# EAGLE board DP_current_measure_v3 (EAGLE 9.6.0), part 1 of 2
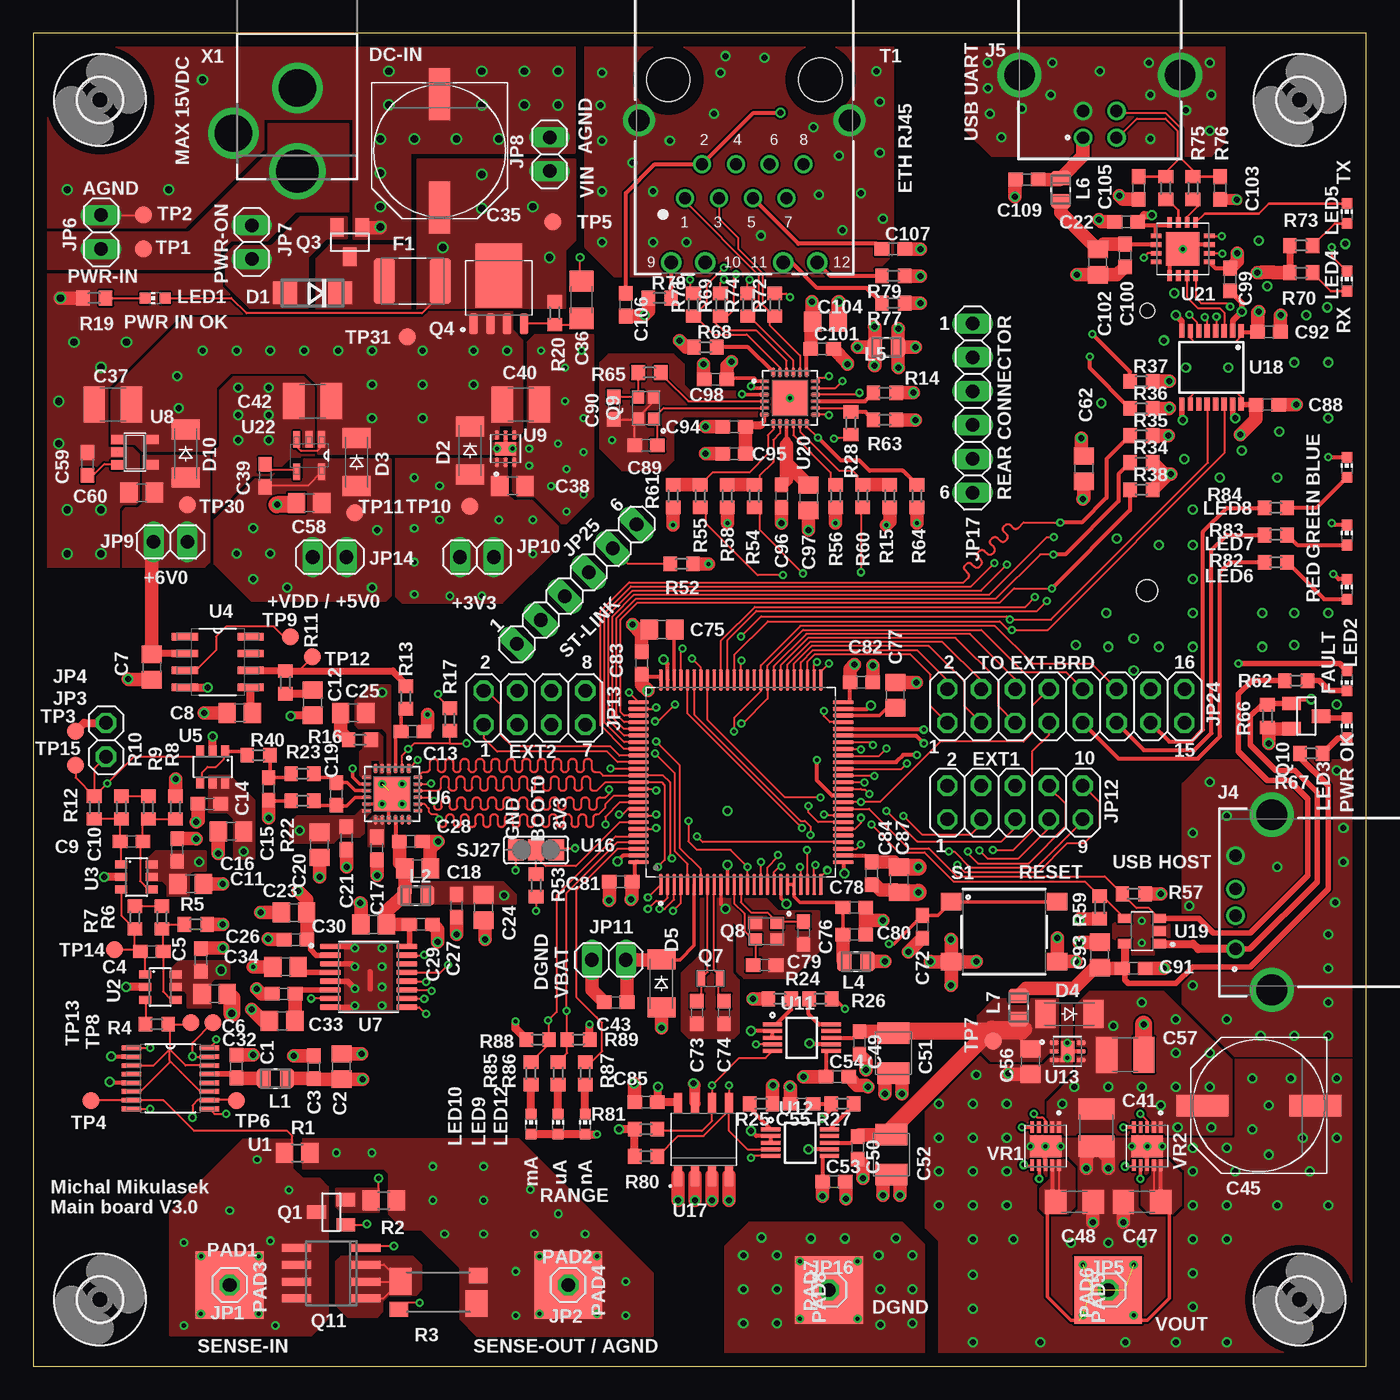
[diagram p6: board, top side]
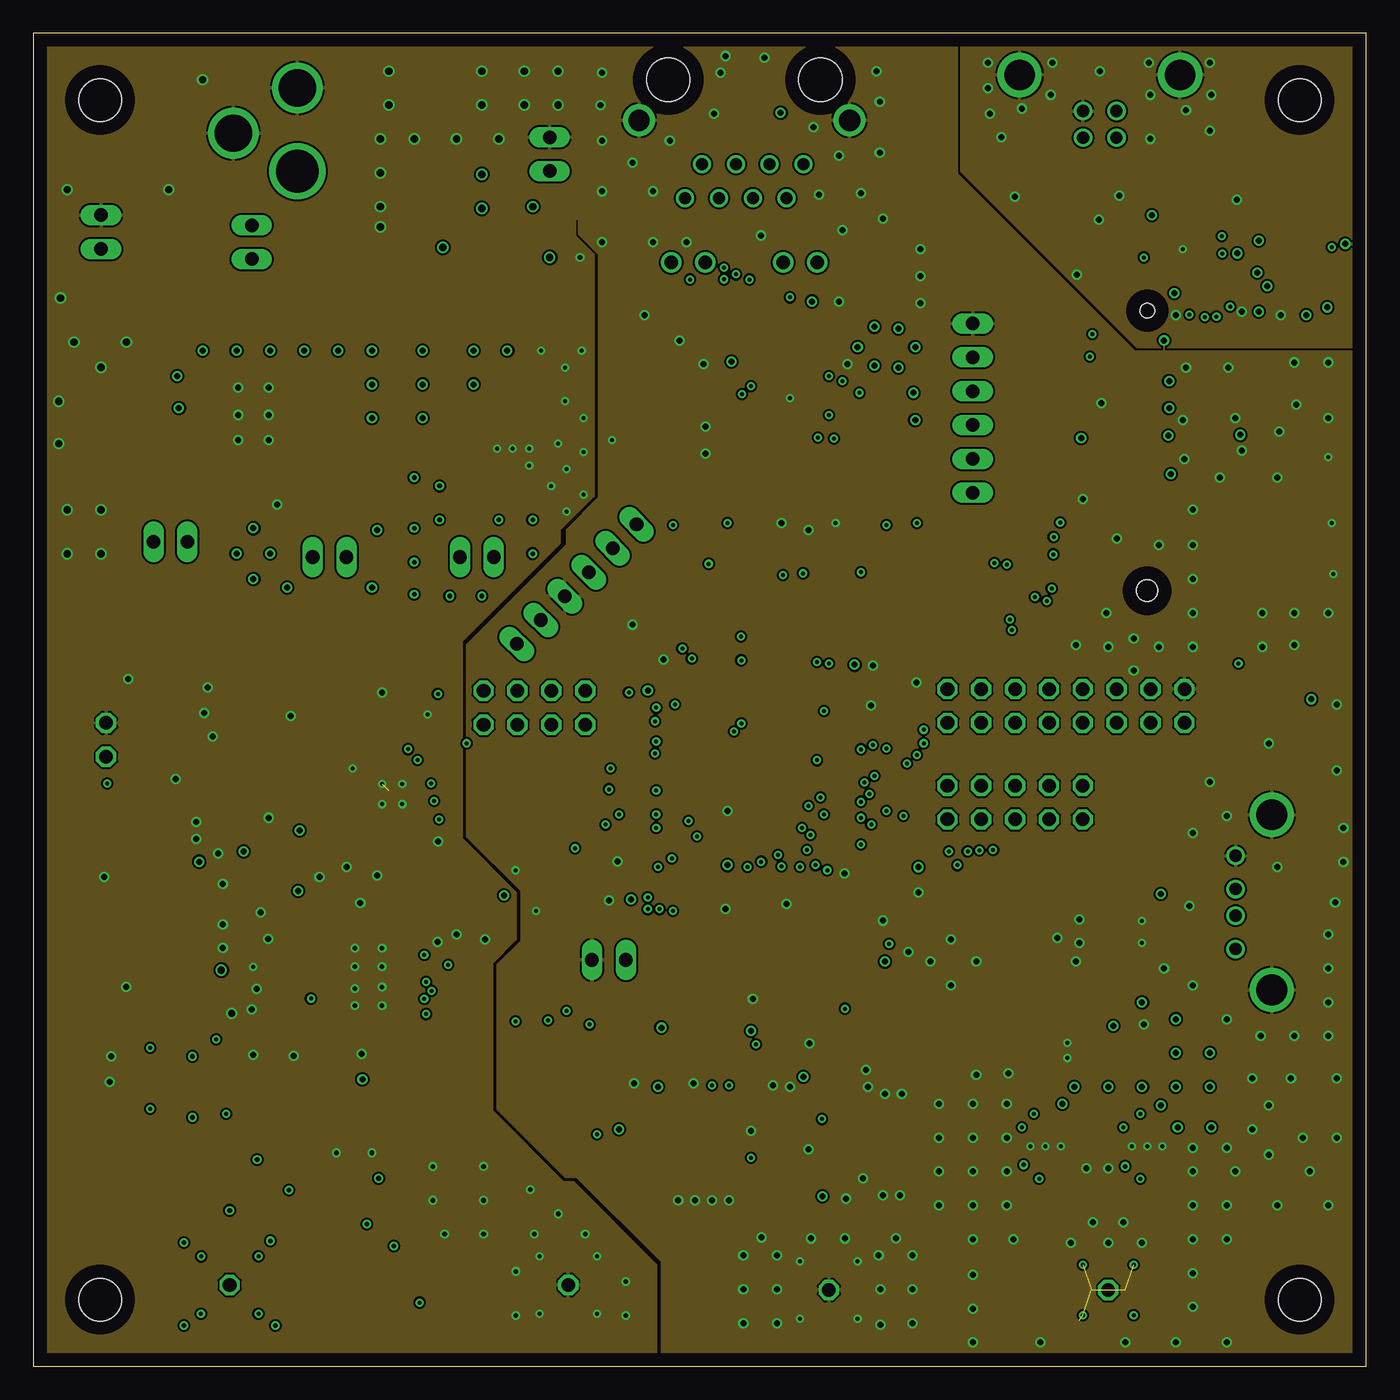
[diagram p7: board, inner layer Route2]
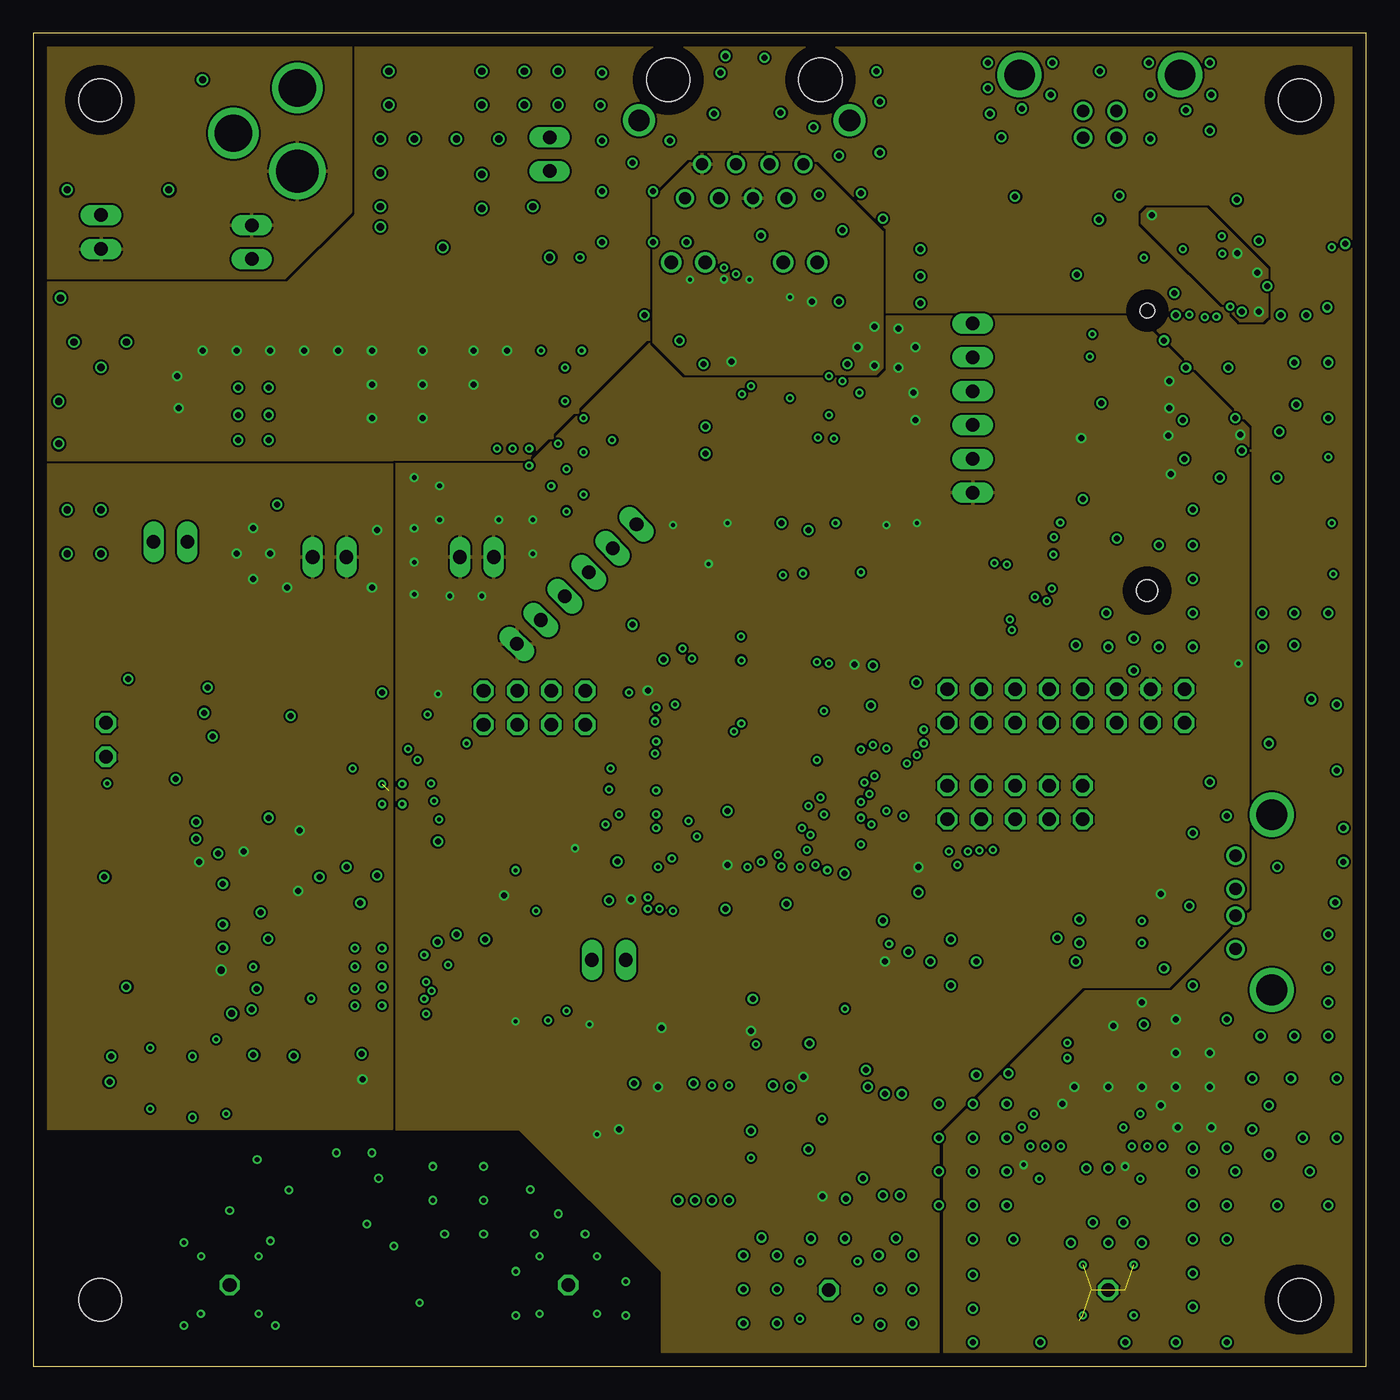
[diagram p8: board, inner layer Route15]
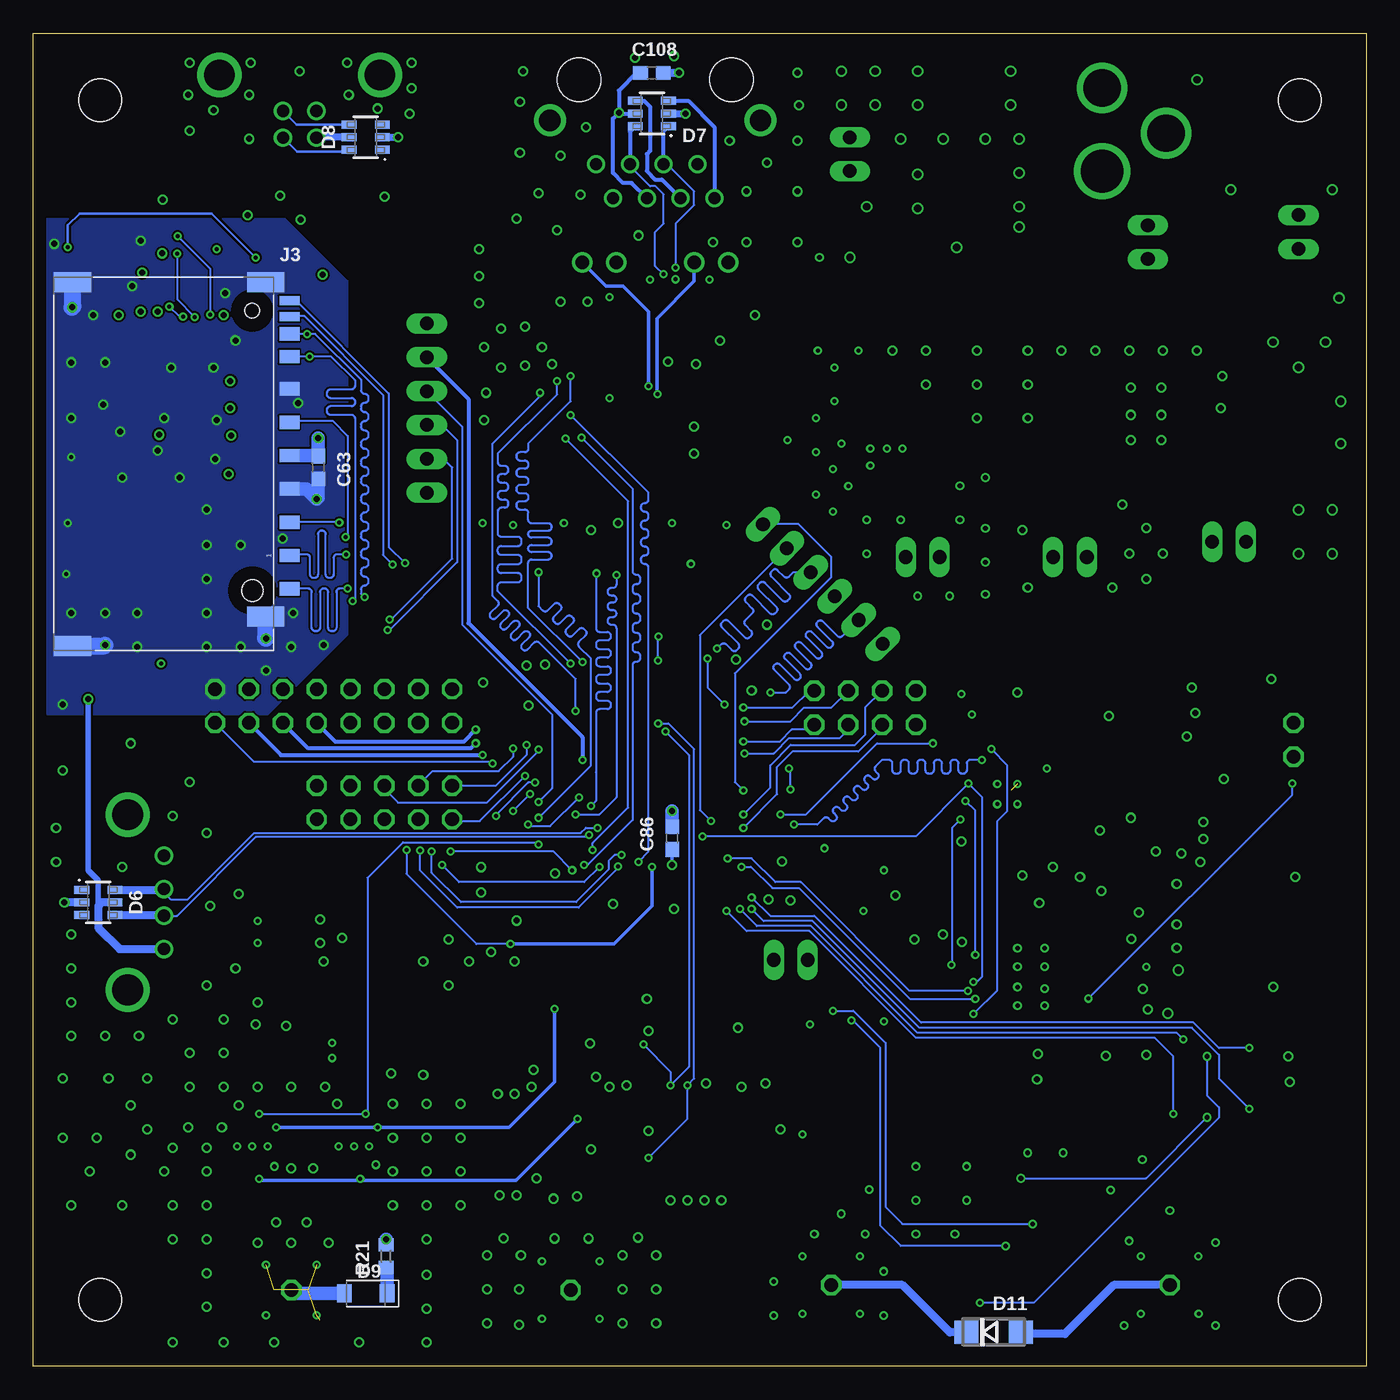
[diagram p9: board, bottom side, seen from below]

Size 100 x 100 mm. Coordinates in mm from the lower left corner, seen from the top.
Outline: 0,0 100,0 100,100 0,100 0,0
Copper layers (1+2*15+16): Top 0.035mm / dielectric 0.2mm / Route2 0.035mm / dielectric 1mm / Route15 0.035mm / dielectric 0.2mm / Bottom 0.035mm
Design rules "PCB_way_4L": minimum track width 6mil, minimum drill 0.3mm, track to track 6mil, track to pad 6mil, pad to pad 6mil, via to via 6mil, smd to smd 6mil, copper to edge 40mil, drill to drill 6mil, minimum pad ring 6mil, minimum via ring 6mil, stop-mask expansion 4mil, vias tented up to drill 0mil, thermal gap 6mil
Net classes: 1 diff_pair: width 0.152 mm

## Footprints (pad centres in the part's own frame; a part is rotated, then mirrored left to right if it is on the bottom)
C0603 = smd 1.1 x 1: 1 -0.85,0; 2 0.85,0
C0805 = smd 1.3 x 1.5: 1 -0.95,0; 2 0.95,0
PANASONIC_G = smd 3.9 x 1.6: + 4.25,0; - -4.25,0
C1206 = smd 1.6 x 1.8: 1 -1.4,0; 2 1.4,0
C1210 = smd 1.6 x 2.7: 1 -1.4,0; 2 1.4,0
SMC_B = smd 1.6 x 2.4: + -1.5,0; - 1.5,0
DO214AC = smd 1.8 x 1.7: A 2.05,0; C -2.05,0
SOD-123_MINI-SMA = smd 1.5 x 2.1: A 1.8,0; C -1.8,0
WE-TVS_SOT23-6L = smd 0.6 x 1.1: 1 -0.95,-1.25; 2 0,-1.25; 3 0.95,-1.25; 4 0.95,1.25; 5 0,1.25; 6 -0.95,1.25
SODFL3718X115 = smd 1.115 x 1.361: 1 -1.6,0; 2 1.6,0
1812 = smd 1.58 x 3.43: 1 -2.1,0; 2 2.1,0
3,2 = hole 3.2: 0,0
693063020911 = smd 1 x 1.5: 1 6.875,0; 2 4.375,0; 3 1.875,0; 4 -0.625,0; 5 -3.125,0; 6 -5.625,0; 7 -8.05,0; 8 -9.75,0; 9 9.375,0 | smd 0.7 x 1.5: CD -11.05,0; WP -12.25,0 | smd 1.5 x 2.8: GND1 -13.65,-1.8; GND2 11.45,-1.8; GND3 13.65,-16.3; GND4 -13.65,-16.3 | hole 1.1: -11.5,-2.8 | hole 1.6: 9.5,-2.8
614004190021 = drill 0.92: 1 -3.5,5.935; 2 -1,5.935; 3 1,5.935; 4 3.5,5.935 | drill 2.3: S1 -6.57,3.225; S2 6.57,3.225
61400416121 = drill 0.92: 1 1.25,6.74; 2 -1.25,6.74; 3 -1.25,4.74; 4 1.25,4.74 | drill 2.3: S1 -6.02,2.03; S2 6.02,2.03
1X01 = drill 1.016 octagon: 1 0,0
1X02 = drill 1.016 long: 1 -1.27,0; 2 1.27,0
2X05 = drill 1.016 octagon: 1 -5.08,-1.27; 2 -5.08,1.27; 3 -2.54,-1.27; 4 -2.54,1.27; 5 0,-1.27; 6 0,1.27; 7 2.54,-1.27; 8 2.54,1.27; 9 5.08,-1.27; 10 5.08,1.27
2X04 = drill 1.016 octagon: 1 -3.81,-1.27; 2 -3.81,1.27; 3 -1.27,-1.27; 4 -1.27,1.27; 5 1.27,-1.27; 6 1.27,1.27; 7 3.81,-1.27; 8 3.81,1.27
1X06 = drill 1.016 long: 1 -6.35,0; 2 -3.81,0; 3 -1.27,0; 4 1.27,0; 5 3.81,0; 6 6.35,0
2X08 = drill 1.016 octagon: 1 -8.89,-1.27; 2 -8.89,1.27; 3 -6.35,-1.27; 4 -6.35,1.27; 5 -3.81,-1.27; 6 -3.81,1.27; 7 -1.27,-1.27; 8 -1.27,1.27; 9 1.27,-1.27; 10 1.27,1.27; 11 3.81,-1.27; 12 3.81,1.27; 13 6.35,-1.27; 14 6.35,1.27; 15 8.89,-1.27; 16 8.89,1.27
BLM21PG331SN1D = smd 1.09 x 1.47: 1 -0.865,0; 2 0.865,0
CHIP-LED0603 = smd 0.8 x 0.8: A 0,-0.75; C 0,0.75
SMD2,54-5,08 = smd 2.54 x 5.08: 1 0,0
SOT23 = smd 1 x 1.4: 1 -0.95,-1.1; 2 0.95,-1.1; 3 0,1.1
TO127P600X120-5N = smd 0.64 x 1.57: 1 -1.905,-2.57; 2 -0.635,-2.57; 3 0.635,-2.57; 4 1.905,-2.57 | smd 3.47 x 4.8: 5 0,1.06
WE-XTAL_IQXC-25 = smd 0.6 x 1.1: 1 -0.7,0; 2 0.7,0
WE-XTAL_CFPX-218 = smd 1 x 0.9: 1 -0.825,-0.613; 2 0.825,-0.613; 3 0.825,0.613; 4 -0.825,0.613
SO8 = smd 0.6 x 2.2: 1 -1.905,-2.6; 2 -0.635,-2.6; 3 0.635,-2.6; 4 1.905,-2.6; 5 1.905,2.6; 6 0.635,2.6; 7 -0.635,2.6; 8 -1.905,2.6
R0805 = smd 1.3 x 1.5: 1 -0.95,0; 2 0.95,0
R2512 = smd 1.39 x 1.14: E1 -0.13,-2.105; E2 5.84,0.435 | smd 1.65 x 2.01: I1 0,0; I2 5.71,-1.67
R0603 = smd 1 x 1.1: 1 -0.85,0; 2 0.85,0
430152080836 = smd 1.55 x 1.3: 1 -3.975,2.25; 2 -3.975,-2.25; 3 3.975,2.25; 4 3.975,-2.25
SJ_2 = smd 1.168 x 1.6: 1 -1.524,0; 2 0,0; 3 1.524,0
7499010121A = drill 0.9: 1 -4.445,-8.89; 2 -3.175,-6.35; 3 -1.905,-8.89; 4 -0.635,-6.35; 5 0.635,-8.89; 6 1.905,-6.35; 7 3.175,-8.89; 8 4.445,-6.35 | drill 1.02: 9 -5.465,-13.72; 10 -2.925,-13.72; 11 2.925,-13.72; 12 5.465,-13.72 | drill 1.6: Z1 -7.9,-3.05; Z2 7.9,-3.05 | hole 3.25: -5.715,0; 5.715,0
B1,27 = smd 1.27 x 1.27: TP 0,0
SOP65P640X110-16N = smd 1.473 x 0.356: 1 -2.921,2.286; 2 -2.921,1.626; 3 -2.921,0.965; 4 -2.921,0.33; 5 -2.921,-0.33; 6 -2.921,-0.965; 7 -2.921,-1.626; 8 -2.921,-2.286; 9 2.921,-2.286; 10 2.921,-1.626; 11 2.921,-0.965; 12 2.921,-0.33; 13 2.921,0.33; 14 2.921,0.965; 15 2.921,1.626; 16 2.921,2.286
SOT23-6 = smd 0.6 x 0.9: 1 -0.95,-1.15; 2 0,-1.15; 3 0.95,-1.15; 4 0.95,1.15; 5 0,1.15; 6 -0.95,1.15
SOIC127P600X175-8N = smd 1.981 x 0.559: 1 -2.464,1.905; 2 -2.464,0.635; 3 -2.464,-0.635; 4 -2.464,-1.905; 5 2.464,-1.905; 6 2.464,-0.635; 7 2.464,0.635; 8 2.464,1.905
24-VFQFN = smd 0.26 x 0.69: 1 -1.25,-1.92; 2 -0.75,-1.92; 3 -0.25,-1.92; 4 0.25,-1.92; 5 0.75,-1.92; 6 1.25,-1.92; 13 1.25,1.92; 14 0.75,1.92; 15 0.25,1.92; 16 -0.25,1.92; 17 -0.75,1.92; 18 -1.25,1.92 | smd 0.69 x 0.26: 7 1.92,-1.25; 8 1.92,-0.75; 9 1.92,-0.25; 10 1.92,0.25; 11 1.92,0.75; 12 1.92,1.25; 19 -1.92,1.25; 20 -1.92,0.75; 21 -1.92,0.25; 22 -1.92,-0.25; 23 -1.92,-0.75; 24 -1.92,-1.25 | smd 2.7 x 2.6: 25 0,0
SOP65P640X120-16N = smd 1.57 x 0.41: 1 -2.87,2.275; 2 -2.87,1.625; 3 -2.87,0.975; 4 -2.87,0.325; 5 -2.87,-0.325; 6 -2.87,-0.975; 7 -2.87,-1.625; 8 -2.87,-2.275; 9 2.87,-2.275; 10 2.87,-1.625; 11 2.87,-0.975; 12 2.87,-0.325; 13 2.87,0.325; 14 2.87,0.975; 15 2.87,1.625; 16 2.87,2.275
SOT23-5 = smd 0.69 x 0.99: 1 -0.95,-1.29; 2 0,-1.29; 3 0.95,-1.29; 4 0.95,1.3; 5 -0.95,1.3
SON65P200X200X80-7N = smd 0.69 x 0.32: 1 -1.02,0.65; 2 -1.02,0; 3 -1.02,-0.65; 4 1.02,-0.65; 5 1.02,0; 6 1.02,0.65 | smd 1 x 1.6: 7 0,0
SOP50P490X95-10N = smd 1.45 x 0.3: 1 -2.2,1; 2 -2.2,0.5; 3 -2.2,0; 4 -2.2,-0.5; 5 -2.2,-1; 6 2.2,-1; 7 2.2,-0.5; 8 2.2,0; 9 2.2,0.5; 10 2.2,1
QFP50P1600X1600X160-100N = smd 1.56 x 0.28: 1 -7.68,6; 2 -7.68,5.5; 3 -7.68,5; 4 -7.68,4.5; 5 -7.68,4; 6 -7.68,3.5; 7 -7.68,3; 8 -7.68,2.5; 9 -7.68,2; 10 -7.68,1.5; 11 -7.68,1; 12 -7.68,0.5; 13 -7.68,0; 14 -7.68,-0.5; 15 -7.68,-1; 16 -7.68,-1.5; 17 -7.68,-2; 18 -7.68,-2.5; 19 -7.68,-3; 20 -7.68,-3.5; 21 -7.68,-4; 22 -7.68,-4.5; 23 -7.68,-5; 24 -7.68,-5.5; 25 -7.68,-6; 51 7.68,-6; 52 7.68,-5.5; 53 7.68,-5; 54 7.68,-4.5; 55 7.68,-4; 56 7.68,-3.5; 57 7.68,-3; 58 7.68,-2.5; 59 7.68,-2; 60 7.68,-1.5; 61 7.68,-1; 62 7.68,-0.5; 63 7.68,0; 64 7.68,0.5; 65 7.68,1; 66 7.68,1.5; 67 7.68,2; 68 7.68,2.5; 69 7.68,3; 70 7.68,3.5; 71 7.68,4; 72 7.68,4.5; 73 7.68,5; 74 7.68,5.5; 75 7.68,6 | smd 0.28 x 1.56: 26 -6,-7.68; 27 -5.5,-7.68; 28 -5,-7.68; 29 -4.5,-7.68; 30 -4,-7.68; 31 -3.5,-7.68; 32 -3,-7.68; 33 -2.5,-7.68; 34 -2,-7.68; 35 -1.5,-7.68; 36 -1,-7.68; 37 -0.5,-7.68; 38 0,-7.68; 39 0.5,-7.68; 40 1,-7.68; 41 1.5,-7.68; 42 2,-7.68; 43 2.5,-7.68; 44 3,-7.68; 45 3.5,-7.68; 46 4,-7.68; 47 4.5,-7.68; 48 5,-7.68; 49 5.5,-7.68; 50 6,-7.68; 76 6,7.68; 77 5.5,7.68; 78 5,7.68; 79 4.5,7.68; 80 4,7.68; 81 3.5,7.68; 82 3,7.68; 83 2.5,7.68; 84 2,7.68; 85 1.5,7.68; 86 1,7.68; 87 0.5,7.68; 88 0,7.68; 89 -0.5,7.68; 90 -1,7.68; 91 -1.5,7.68; 92 -2,7.68; 93 -2.5,7.68; 94 -3,7.68; 95 -3.5,7.68; 96 -4,7.68; 97 -4.5,7.68; 98 -5,7.68; 99 -5.5,7.68; 100 -6,7.68
SOIC127P600X175-8N' = smd 1.55 x 0.6: 1 -2.7,1.905; 2 -2.7,0.635; 3 -2.7,-0.635; 4 -2.7,-1.905; 5 2.7,-1.905; 6 2.7,-0.635; 7 2.7,0.635; 8 2.7,1.905
QSOP16 = smd 0.4 x 1: 1 -2.223,-2.75; 2 -1.588,-2.75; 3 -0.953,-2.75; 4 -0.318,-2.75; 5 0.318,-2.75; 6 0.953,-2.75; 7 1.588,-2.75; 8 2.223,-2.75; 9 2.223,2.75; 10 1.588,2.75; 11 0.953,2.75; 12 0.318,2.75; 13 -0.318,2.75; 14 -0.953,2.75; 15 -1.588,2.75; 16 -2.223,2.75
SOT-23-5 = smd 1 x 0.7: 1 -1.3,0.95; 2 -1.3,0; 3 -1.3,-0.95; 4 1.3,-0.95; 5 1.3,0.95
QFN16-4X4 = smd 0.8 x 0.35: 1 -2,0.975; 2 -2,0.325; 3 -2,-0.325; 4 -2,-0.975; 9 2,-0.975; 10 2,-0.325; 11 2,0.325; 12 2,0.975 | smd 0.35 x 0.8: 5 -0.975,-2; 6 -0.325,-2; 7 0.325,-2; 8 0.975,-2; 13 0.975,2; 14 0.325,2; 15 -0.325,2; 16 -0.975,2 | smd 2.5 x 2.5: EXP 0,0
SOT95P280X100-5N = smd 1.219 x 0.508: 1 -1.219,0.94; 2 -1.219,0; 3 -1.219,-0.94; 4 1.219,-0.94; 5 1.219,0.94
SON50P300X300X80-11N = smd 0.86 x 0.27: 1 -1.435,1; 2 -1.435,0.5; 3 -1.435,0; 4 -1.435,-0.5; 5 -1.435,-1; 6 1.435,-1; 7 1.435,-0.5; 8 1.435,0; 9 1.435,0.5; 10 1.435,1 | smd 1.65 x 2.38: 11 0,0
DCJACK_2MM_PTH = drill 2.8: GND 0,7.35; GNDBREAK 4.8,10.75 | drill 3.2: PWR 0,13.6

## Placement (x,y rotation side)
C1  100n / 0603  [C0603]  15.24,22.48 90 top
C2  10u / 0805  [C0805]  23.11,22.48 90 top
C3  100n / 0603  [C0603]  21.06,22.43 90 top
C4  10p / 0603 NP0  [C0603]  8.89,31.11 180 top
C5  100n / 0603  [C0603]  12.57,30.48 90 top
C6  10u / 0805  [C0805]  13.59,27.94 0 top
C7  10u / 0805  [C0805]  8.89,52.45 270 top
C8  10u / 0805  [C0805]  15.49,49.02 180 top
C9  10p / 0603 NP0  [C0603]  7.37,39.37 180 top
C10  100n / 0603  [C0603]  10.79,38.73 90 top
C11  10u / 0805  [C0805]  11.81,36.2 0 top
C12  10u / 0805  [C0805]  20.95,49.78 270 top
C13  1u / 0603  [C0603]  28.45,47.62 0 top
C14  100n / 0603  [C0603]  13.21,42.19 180 top
C15  10n / 0603  [C0603]  17.65,43.31 270 top
C16  10u / 0805  [C0805]  14.83,40.13 180 top
C17  1u / 0603  [C0603]  25.78,38.86 270 top
C18  10u / 0805  [C0805]  28.83,37.34 0 top
C19  10n / 0603 NP0  [C0603]  22.73,42.93 270 top
C20  10u / 0805  [C0805]  21.46,39.12 270 top
C21  100n / 0603  [C0603]  23.5,39.62 270 top
C22  100n / 0603  [C0603]  81.99,85.85 180 top
C23  10u / 0805  [C0805]  19.56,34.04 180 top
C24  10u / 0805  [C0805]  33.78,34.42 270 top
C25  22u / 0805  [C0805]  24,49.02 0 top
C26  100n / 0603  [C0603]  19.68,32 180 top
C27  100n / 0603  [C0603]  31.75,34.54 270 top
C28  100n / 0603  [C0603]  28.32,39.37 0 top
C29  100n / 0603  [C0603]  29.08,33.15 0 top
C30  10u / 0805  [C0805]  25.53,33.15 180 top
C32  1u / 0603  [C0603]  18.8,27.94 180 top
C33  10u / 0805  [C0805]  18.67,25.91 180 top
C34  10u / 0805  [C0805]  18.92,29.97 180 top
C35  470u  [PANASONIC_G]  30.48,91.19 270 top
C36  10u / 1206  [C1206]  41.15,80.01 90 top
C37  22u / 1210  [C1210]  5.97,72.14 180 top
C38  10u / 0805  [C0805]  35.94,66.04 0 top
C39  10n / 0603  [C0603]  17.4,66.8 270 top
C40  22u / 1210  [C1210]  36.58,72.14 0 top
C41  22u / 1210  [C1210]  79.76,17.91 270 top
C42  22u / 1210  [C1210]  20.95,72.39 180 top
C43  100n / 0603  [C0603]  43.69,27.3 180 top
C45  470u  [PANASONIC_G]  91.95,19.56 180 top
C47  10u / 1206  [C1206]  83.19,12.32 180 top
C48  10u / 1206  [C1206]  78.11,12.32 0 top
C49  100n / 0603  [C0603]  61.98,24.26 270 top
C50  100n / 0603  [C0603]  61.85,16.38 270 top
C51  10u  [SMC_B]  64.52,23.5 270 top
C52  10u  [SMC_B]  64.39,15.88 270 top
C53  100n / 0603  [C0603]  60.07,13.84 0 top
C54  100n / 0603  [C0603]  60.33,21.72 0 top
C55  470n / 0603  [C0603]  57.66,19.68 180 top
C56  10u / 0805  [C0805]  74.8,22.86 270 top
C57  22u / 1210  [C1210]  81.92,23.37 0 top
C58  10u / 0805  [C0805]  20.7,64.77 180 top
C59  100n / 0603  [C0603]  4.06,67.69 90 top
C60  10u / 0805  [C0805]  8.13,65.53 180 top
C62  10u / 0805  [C0805]  78.82,67.34 270 top
C63  100n / 0603  [C0603]  78.61,67.44 270 bottom
C72  100n / 0603  [C0603]  66.7,32.97 270 top
C73  14p / 0603 NP0  [C0603]  49.78,26.54 270 top
C74  14p / 0603 NP0  [C0603]  51.82,26.54 270 top
C75  2,2u / 0805  [C0805]  47.17,55.27 180 top
C76  12pF / 0603 NP0  [C0603]  57.78,32.51 270 top
C77  2,2u / 0805  [C0805]  64.67,50.34 90 top
C78  100n / 0603  [C0603]  61.59,34.42 0 top
C79  12pF / 0603 NP0  [C0603]  54.86,30.1 0 top
C80  1u / 0603  [C0603]  61.59,32.38 0 top
C81  100n / 0603  [C0603]  44.07,36.35 180 top
C82  100n / 0603  [C0603]  62.13,51.31 0 top
C83  100n / 0603  [C0603]  45.64,52.76 90 top
C84  100n / 0603  [C0603]  62.89,36.98 270 top
C85  100n / 0603  [C0603]  45.97,19.81 180 top
C86  100n / 0603  [C0603]  52.07,39.62 90 bottom
C87  10u / 0805  [C0805]  64.95,36.5 270 top
C88  100n / 0603  [C0603]  92.58,72.14 0 top
C89  12pF / 0603 NP0  [C0603]  45.97,69.09 180 top
C90  12pF / 0603 NP0  [C0603]  43.56,71.88 270 top
C91  100n / 0603  [C0603]  82.55,29.84 0 top
C92  100n / 0603  [C0603]  92.71,77.6 0 top
C93  10u / 0805  [C0805]  80.01,30.86 90 top
C94  470p / 0603  [C0603]  52.58,70.48 180 top
C95  1u / 0603  [C0603]  52.58,68.45 180 top
C96  100n / 0603  [C0603]  56.13,65.28 270 top
C97  10u / 0805  [C0805]  58.17,65.15 270 top
C98  100n / 0603  [C0603]  51.18,74.04 180 top
C99  100n / 0603  [C0603]  89.79,81.53 270 top
C100  100n / 0603  [C0603]  81.92,83.34 270 top
C101  100n / 0603  [C0603]  59.18,76.33 0 top
C102  10u / 0805  [C0805]  79.86,82.83 270 top
C103  47p / 0603  [C0603]  89.03,88.39 270 top
C104  10u / 0805  [C0805]  59.44,78.36 0 top
C105  47p / 0603  [C0603]  82.93,88.39 270 top
C106  100n / 0603  [C0603]  44.45,79.63 270 top
C107  100n / 0603  [C0603]  64.52,83.82 0 top
C108  100n / 0603  [C0603]  53.59,97.03 0 bottom
C109  10n / 0603  [C0603]  74.55,89.03 180 top
D1  S3M  [DO214AC]  20.95,80.52 180 top
D2  1N5819HW-7-F  [SOD-123_MINI-SMA]  32.77,68.71 270 top
D3  1N5819HW-7-F  [SOD-123_MINI-SMA]  24.26,67.82 270 top
D4  1N5819HW-7-F  [SOD-123_MINI-SMA]  77.72,26.42 180 top
D5  1N5819HW-7-F  [SOD-123_MINI-SMA]  47.12,28.7 270 top
D6  USBLC6-4SC6  [WE-TVS_SOT23-6L]  95.12,34.8 270 bottom
D7  USBLC6-4SC6  [WE-TVS_SOT23-6L]  53.59,93.98 90 bottom
D8  USBLC6-4SC6  [WE-TVS_SOT23-6L]  75.06,92.2 90 bottom
D9  BZT52-B5V6J  [SODFL3718X115]  75.06,5.46 180 bottom
D10  1N5819HW-7-F  [SOD-123_MINI-SMA]  11.43,68.45 270 top
D11  Clamp_diode  [DO214AC]  27.94,2.54 0 bottom
F1  [1812]  28.45,81.41 0 top
H1  MOUNT-HOLE3.2  [3,2]  5,95 0 top
H2  MOUNT-HOLE3.2  [3,2]  5,5 0 top
H3  MOUNT-HOLE3.2  [3,2]  95,95 0 top
H4  MOUNT-HOLE3.2  [3,2]  95,5 0 top
J3  [693063020911]  80.77,67.69 270 bottom
J4  [614004190021]  96.14,34.8 90 top
J5  [61400416121]  80.01,98.91 180 top
JP1  [1X01]  14.73,6.1 90 top
JP2  [1X01]  40.13,6.1 90 top
JP3  [1X01]  5.46,45.72 90 top
JP4  [1X01]  5.46,48.26 90 top
JP5  [1X01]  80.64,5.71 0 top
JP6  [1X02]  5.08,85.09 90 top
JP7  [1X02]  16.38,84.33 270 top
JP8  [1X02]  38.73,90.93 90 top
JP9  [1X02]  10.29,61.85 0 top
JP10  [1X02]  33.27,60.71 0 top
JP11  [1X02]  43.18,30.48 180 top
JP12  [2X05]  73.66,42.29 0 top
JP13  [2X04]  37.59,49.4 0 top
JP14  [1X02]  22.23,60.71 0 top
JP16  [1X01]  59.69,5.71 0 top
JP17  [1X06]  70.48,71.88 270 top
JP24  [2X08]  77.47,49.53 0 top
JP25  [1X06]  40.77,58.67 45 top
L1  [BLM21PG331SN1D]  18.16,21.59 0 top
L2  [BLM21PG331SN1D]  28.7,35.31 0 top
L4  [BLM21PG331SN1D]  61.72,30.35 180 top
L5  [BLM21PG331SN1D]  64.01,76.45 180 top
L6  [BLM21PG331SN1D]  77.09,88.27 90 top
L7  [BLM21PG331SN1D]  73.91,26.92 90 top
LED1  GREEN_TOP  [CHIP-LED0603]  9.14,80.14 90 top
LED2  RED_SIDE  [CHIP-LED0603]  98.55,51.44 180 top
LED3  GREEN_SIDE  [CHIP-LED0603]  98.55,47.88 0 top
LED4  GREEN_SIDE  [CHIP-LED0603]  98.55,81.41 0 top
LED5  GREEN_SIDE  [CHIP-LED0603]  98.55,86.49 0 top
LED6  RED_TOP  [CHIP-LED0603]  98.55,58.29 0 top
LED7  GREEN_TOP  [CHIP-LED0603]  98.55,62.36 0 top
LED8  BLUE_TOP  [CHIP-LED0603]  98.55,67.44 0 top
LED9  GREEN_TOP  [CHIP-LED0603]  39.37,18.16 0 top
LED10  BLUE_TOP  [CHIP-LED0603]  37.34,18.16 0 top
LED12  RED_TOP  [CHIP-LED0603]  41.4,18.16 0 top
PAD1  [SMD2,54-5,08]  16,6.1 180 top
PAD2  [SMD2,54-5,08]  38.86,6.1 180 top
PAD3  [SMD2,54-5,08]  13.46,6.1 180 top
PAD4  [SMD2,54-5,08]  41.4,6.1 180 top
PAD5  [SMD2,54-5,08]  81.92,5.71 0 top
PAD6  [SMD2,54-5,08]  79.38,5.71 0 top
PAD7  [SMD2,54-5,08]  58.42,5.71 0 top
PAD8  [SMD2,54-5,08]  60.96,5.71 0 top
Q1  DMG3414UQ-7  [SOT23]  22.35,11.56 90 top
Q3  DMG3401LSN-7  [SOT23]  23.75,84.33 180 top
Q4  PHPT60603NYX  [TO127P600X120-5N]  34.92,80.77 0 top
Q7  32.768kHz (9pF)/±10 ppm  [WE-XTAL_IQXC-25]  50.8,29.08 0 top
Q8  20MHz (8pF)/±10 ppm  [WE-XTAL_CFPX-218]  54.99,32.64 180 top
Q9  25MHz (8pF)/±10 ppm  [WE-XTAL_CFPX-218]  45.97,71.88 90 top
Q10  DMG3414UQ-7  [SOT23]  95.5,48.77 270 top
Q11  DMN2009USS  [SO8]  22.35,6.99 90 top
R1  10K 0.05%  [R0805]  19.81,16 0 top
R2  10R 0.05%  [R0805]  26.29,12.45 0 top
R3  R01 0.05%  [R2512]  33.27,4.7 180 top
R4  270R  [R0603]  9.27,25.65 180 top
R5  1K 0.05%  [R0603]  12.19,33.15 180 top
R6  6K8 0.05%  [R0603]  9.65,33.66 90 top
R7  2K2 0.05%  [R0603]  7.62,33.66 270 top
R8  1K 0.05%  [R0603]  10.67,41.91 90 top
R9  6K8 0.05%  [R0603]  8.64,41.91 270 top
R10  2K2 0.05%  [R0603]  6.6,41.91 90 top
R11  1R  [R0603]  18.92,51.31 270 top
R12  270R  [R0603]  4.57,41.91 90 top
R13  330R  [R0603]  27.94,50.16 270 top
R14  10K  [R0603]  63.88,73.03 180 top
R15  10K  [R0603]  64.26,65.28 90 top
R16  1R  [R0603]  24.51,46.99 0 top
R17  10K  [R0603]  31.24,48.51 90 top
R19  4K7  [R0603]  4.57,80.14 0 top
R20  1K  [R0603]  39.12,78.99 270 top
R21  1K  [R0603]  73.53,8.26 270 bottom
R22  2R2 1%  [R0603]  20.19,42.42 0 top
R23  2R2 1%  [R0603]  20.19,44.45 0 top
R24  1R  [R0603]  56.01,27.56 0 top
R25  1R  [R0603]  54.61,19.68 180 top
R26  330R  [R0603]  59.05,27.56 0 top
R27  4K7  [R0603]  60.71,19.68 180 top
R28  33R  [R0603]  61.34,70.74 270 top
R34  10K  [R0603]  83.13,67.79 0 top
R35  10K  [R0603]  83.13,69.82 0 top
R36  10K  [R0603]  83.13,71.86 0 top
R37  10K  [R0603]  83.13,73.89 0 top
R38  10K  [R0603]  83.13,65.76 0 top
R40  33R  [R0603]  16.89,45.85 0 top
R52  10K  [R0603]  48.64,60.2 0 top
R53  10K  [R0603]  37.72,36.07 90 top
R54  33R  [R0603]  54.1,65.28 270 top
R55  33R  [R0603]  50.04,65.28 270 top
R56  10K  [R0603]  60.2,65.28 270 top
R57  47K  [R0603]  82.55,35.43 180 top
R58  10K  [R0603]  52.07,65.28 90 top
R59  10K  [R0603]  80.01,34.42 270 top
R60  33R  [R0603]  62.23,65.28 270 top
R61  10K  [R0603]  48.01,65.28 90 top
R62  330R  [R0603]  94.74,51.44 180 top
R63  10K  [R0603]  63.88,70.99 180 top
R64  1K5  [R0603]  66.29,65.28 90 top
R65  500R  [R0603]  46.23,74.55 180 top
R66  10K  [R0603]  92.58,48.77 270 top
R67  330R  [R0603]  95.89,45.97 0 top
R68  12K1 1%  [R0603]  50.42,76.45 0 top
R69  49,9R  [R0603]  51.56,79.63 90 top
R70  330R  [R0603]  95.12,82.04 180 top
R71  49,9R  [R0603]  49.53,79.63 90 top
R72  49,9R  [R0603]  55.63,79.63 90 top
R73  330R  [R0603]  95.12,84.07 180 top
R74  49,9R  [R0603]  53.59,79.63 90 top
R75  27R  [R0603]  84.96,88.39 90 top
R76  27R  [R0603]  87,88.39 90 top
R77  270R  [R0603]  64.52,79.76 180 top
R78  270R  [R0603]  46.99,80.14 0 top
R79  10K  [R0603]  64.52,81.79 180 top
R80  4K7  [R0603]  45.97,15.75 180 top
R81  4K7  [R0603]  45.97,17.78 180 top
R82  330R  [R0603]  93.22,60.33 180 top
R83  330R  [R0603]  93.22,62.36 180 top
R84  330R  [R0603]  93.22,64.39 180 top
R85  330R  [R0603]  37.34,21.97 90 top
R86  330R  [R0603]  39.37,21.97 90 top
R87  330R  [R0603]  41.4,21.97 90 top
R88  10K  [R0603]  37.85,24.51 180 top
R89  10K  [R0603]  40.89,24.51 0 top
S1  [430152080836]  72.85,32.59 0 top
SJ27  [SJ_2]  37.72,38.73 0 top
T1  [7499010121A]  53.34,96.52 0 top
TP1  TPSB1,27  [B1,27]  8.26,83.82 0 top
TP2  TPSB1,27  [B1,27]  8.26,86.36 0 top
TP3  TPSB1,27  [B1,27]  3.17,47.62 0 top
TP4  TPSB1,27  [B1,27]  4.32,19.94 0 top
TP5  TPSB1,27  [B1,27]  38.99,85.85 0 top
TP6  TPSB1,27  [B1,27]  15.24,19.94 0 top
TP7  TPSB1,27  [B1,27]  72.01,24.38 90 top
TP8  TPSB1,27  [B1,27]  13.46,25.78 0 top
TP9  TPSB1,27  [B1,27]  19.3,54.74 0 top
TP10  TPSB1,27  [B1,27]  32.77,64.52 180 top
TP11  TPSB1,27  [B1,27]  24.13,64.01 180 top
TP12  TPSB1,27  [B1,27]  20.95,53.21 0 top
TP13  TPSB1,27  [B1,27]  11.81,25.78 0 top
TP14  TPSB1,27  [B1,27]  6.1,31.24 0 top
TP15  TPSB1,27  [B1,27]  3.17,45.09 0 top
TP30  TPSB1,27  [B1,27]  11.56,64.64 180 top
TP31  TPSB1,27  [B1,27]  28.07,77.22 0 top
U1  TMUX1111PWRTSSOP16  [SOP65P640X110-16N]  10.29,21.59 0 top
U2  MAX4239AUT+T  [SOT23-6]  9.53,28.45 270 top
U3  AD8628  [SOT23-6]  7.75,36.7 270 top
U4  REF5050IDR  [SOIC127P600X175-8N]  13.84,52.83 0 top
U5  AD8628  [SOT23-6]  13.46,44.96 180 top
U6  ADS8900BRGET  [24-VFQFN]  26.92,42.93 180 top
U7  ADS8681IPWR  [SOP65P640X120-16N]  25.15,29.21 0 top
U8  LK112M60TR  [SOT23-5]  7.62,68.58 270 top
U9  TLV76733DRVR  [SON65P200X200X80-7N]  35.43,68.83 90 top
U11  AD5259BRMZ10  [SOP50P490X95-10N]  57.66,24.64 0 top
U12  AD5259BRMZ50  [SOP50P490X95-10N]  57.53,16.76 0 top
U13  TLV76750DRVT  [SON65P200X200X80-7N]  77.6,23.62 0 top
U16  STM32F767VIT6  [QFP50P1600X1600X160-100N]  53.09,43.81 90 top
U17  AT24C256C-SSHL-T  [SOIC127P600X175-8N']  50.29,17.02 90 top
U18  SI8642BB-B-IU  [QSOP16]  88.39,74.93 180 top
U19  STMPS2151STR  [SOT-23-5]  83.19,32.64 180 top
U20  LAN8742A-CZ-TR  [24-VFQFN]  56.77,72.64 270 top
U21  FT230XQ-R  [QFN16-4X4]  86.23,83.82 180 top
U22  LT1761ES5-5TRMPBF  [SOT95P280X100-5N]  20.7,68.33 270 top
VR1  LT3045EDD#TRPBF  [SON50P300X300X80-11N]  75.95,16.51 270 top
VR2  LT3045EDD#TRPBF  [SON50P300X300X80-11N]  83.57,16.51 270 top
X1  [DCJACK_2MM_PTH]  19.81,103.25 180 top

## Tracks (layer width: path | path; a pad name or v marks a point on that pad's centre or on a via)
+3V3  (via drill 0.3, 0.35, 0.45)
  Top 0.152: R17.2 30.35,50.25 v30.35,50.42 | U18.10 86.8,72.71 87.12,73.03 90.3,73.03 90.61,72.71 U18.16 | SJ27.3 39.37,38.86 v40.64,38.86
  Top 0.254: U16.11 52.09,37.58 v52.07,37.59
  Top 0.305: U16.27 62.41,38.31 C84.1 | C82.1 61.28,49.84 61.25,49.81 U16.50 | U16.75 47.09,51.75 45.8,51.75 C83.1 | U16.100 45.15,37.81 45.15,36.58 C81.1 | v53.85,25.15 53.86,25.14 U11.2 U11.3 | U12.6 59.22,15.76 C53.1 | U11.6 59.48,23.64 C54.1
  Top 0.406: U18.16 90.66,72.14 C88.1 | LED2.A 98.03,52.7 v90.42,52.7
  Top 0.61: LED10.A LED9.A LED12.A 42.28,17.41 v42.29,17.4 | U17.8 48.29,19.81 C85.1 46.86,19.85 v46.86,20.95 | R80.2 R81.2 v43.94,17.78 | R88.2 36.17,25.34 v36.17,25.88 | R89.2 41.74,25.62 v41.73,25.63
  Top 1.016: L4.1 v63.88,30.35 | R35.2 v85.17,69.83 | R57.1 v84.58,35.43 | C84.1 64.56,37.83 C87.1 | D5.A v47.12,25.4 | C81.1 44.92,35.12 v44.83,35.03 | C83.1 45.64,51.16 v46.1,50.7 | C53.1 59.22,12.76 v59.21,12.75 | C54.1 v57.78,21.72 | C62.1 78.61,68.49 v78.61,69.62 | C88.1 91.73,71.06 v90.55,69.88 | C82.1 61.28,52.29 v61.62,52.63 | L5.1 64.87,77.83 v64.9,77.85 | L5.1 v66.17,76.45 | L5.1 64.87,74.95 v64.9,74.93 | R61.1 v48.01,63.12 | R14.1 v66.04,73.03 | R63.1 v66.17,70.99 | R58.1 v52.07,63.25 | R15.1 64.26,63.37 v64.01,63.12 | R64.1 v66.29,63.25 | R52.2 v50.67,60.2 | R37.2 85.19,73.89 v85.22,73.91 | R34.2 84.85,66.93 v85.34,66.93 85.15,66.93 R38.2 | R36.2 85.19,71.86 v85.22,71.88
  Top 1.27: C87.1 66.39,37.45 v66.4,37.44
  Bottom 0.254: v52.07,37.59 C86.1
  Bottom 1.016: v78.61,69.62 C63.1 78.64,68.32 J3.4
  other vias: 28.57,66.67 30.48,66.04 28.57,60.33 34.92,63.5 37.47,63.5 33.66,57.78 37.47,60.96 31.24,57.78 28.57,57.91 30.48,63.5 28.57,62.87 35.33,35.31
  pour Top (rank 3, no thermals): 35.56,68.07 27.18,68.07 27.18,57.78 27.69,57.28 35.18,57.28 39.37,61.47 39.37,62.99 37.47,64.9 36.07,64.9 35.56,65.41
  pour Top (no thermals): 29.21,34.67 29.21,36.32 35.26,36.32 36.17,35.41 36.17,34.67
  pour Route15 (rank 2): 27.05,17.78 36.45,17.78 47.12,7.11 47.12,-3.17 67.94,-3.17 67.94,17.65 78.74,28.45 85.22,28.45 91.19,34.42 91.19,70.36 82.8,78.74 48.26,78.74 37.21,67.69 27.05,67.69
+5V_DIG
  Top 0.305: U12.8 61.38,16.76 C50.1 | U11.8 61.51,24.64 C49.1
  Top 1.016: C50.1 61.99,17.38 C52.+ | C49.1 64.4,25.11 C51.+
  Top 1.27: C52.+ 64.39,17.78 71.89,25.27 74.3,25.27 74.13,25.11 64.4,25.11
  pour Top (no thermals): 72.12,27.54 76.87,27.54 76.87,23.5 76.2,23.5 75.56,22.86 71.88,22.86 70.87,23.88 70.87,26.29
+6V
  Top 0.508: U4.2 8.96,53.47 C7.1
  Top 1.016: JP9.1 8.89,61.72 C7.1
  pour Top (rank 2, no thermals): 8.26,68.33 13.21,68.33 13.21,60.33 12.83,59.94 6.73,59.94 6.73,64.14 6.99,64.39 7.87,64.39 8.26,64.77
ADC_CONVST  (via drill 0.3)
  Top 0.152: v28.83,45.49 28.57,45.23 28.55,45.23 U6.1 | v42.93,40.63 42.93,41.23 44.02,42.31 U16.91
  Bottom 0.152: v28.83,45.49 29.7,45.49 arc-90 29.97,45.22 29.97,44.72 arc90 30.23,44.45 30.32,44.45 arc90 30.59,44.72 30.59,45.22 arc-90 30.85,45.49 30.94,45.49 arc-90 31.21,45.22 31.21,44.72 arc90 31.47,44.45 31.56,44.45 arc90 31.83,44.72 31.83,45.22 arc-90 32.09,45.49 32.18,45.49 arc-90 32.45,45.22 32.45,44.72 arc90 32.71,44.45 32.8,44.45 arc90 33.07,44.72 33.07,45.22 arc-90 33.33,45.49 33.42,45.49 arc-90 33.69,45.22 33.69,44.72 arc90 33.95,44.45 34.04,44.45 arc90 34.31,44.72 34.31,45.22 arc-90 34.57,45.49 34.66,45.49 arc-90 34.93,45.22 34.93,44.72 arc90 35.19,44.45 35.28,44.45 arc90 35.55,44.72 35.55,45.22 arc-90 35.81,45.49 36.32,45.49 36.8,45.01 arc-90 36.8,44.63 36.66,44.49 arc90 36.66,44.11 36.67,44.09 arc90 37.05,44.09 37.2,44.24 arc-90 37.57,44.24 37.59,44.22 arc-90 37.59,43.85 37.44,43.7 arc90 37.44,43.32 37.46,43.31 arc90 37.84,43.31 37.98,43.45 arc-90 38.36,43.45 38.37,43.44 arc-90 38.37,43.06 38.23,42.91 arc90 38.23,42.54 38.24,42.52 arc90 38.62,42.52 38.77,42.67 arc-90 39.14,42.67 39.16,42.65 arc-90 39.16,42.27 39.01,42.13 arc90 39.01,41.75 39.03,41.74 arc90 39.41,41.74 39.55,41.88 arc-90 39.93,41.88 39.95,41.87 arc-90 39.95,41.49 39.8,41.34 arc90 39.8,40.97 39.82,40.95 arc90 40.19,40.95 40.34,41.1 arc-90 40.72,41.1 41.18,40.63 v42.93,40.63
ADC_DIG_IC
  Top 0.305: U6.16 27.17,39.67 C28.1
  Top 0.406: U7.16 28.23,31.48 C29.1
  Top 1.016: C29.1 C30.1 26.48,34.13 L2.1 27.88,35.53 C18.1 27.47,37.75 C28.1
ADC_RST  (via drill 0.3)
  Top 0.152: v43.94,41.39 43.95,41.4 44.2,41.4 44.61,41.81 U16.92 | U6.2 27.67,45.84 v28.13,46.29 28.57,46.74 31.24,46.74 | R17.1 31.24,46.74 | 31.24,46.74 v32.51,46.74 | U7.9 28.95,26.93 v29.46,26.42
  Bottom 0.152: v43.94,41.39 42.05,41.39 36.7,46.74 v32.51,46.74 | v29.46,26.42 27.69,28.19 27.69,40.89 26.92,41.66 26.92,45.09 v28.13,46.29
ADC_RVS  (via drill 0.3)
  Top 0.152: U6.21 29.79,42.68 arc-90 v30.06,42.41 30.06,42.02 arc90 30.33,41.76 30.38,41.76 arc90 30.64,42.02 30.64,42.41 arc-90 30.91,42.68 30.96,42.68 arc-90 31.22,42.41 31.22,42.02 arc90 31.49,41.76 31.54,41.76 arc90 31.81,42.02 31.81,42.41 arc-90 32.07,42.68 32.12,42.68 arc-90 32.39,42.41 32.39,42.02 arc90 32.65,41.76 32.7,41.76 arc90 32.97,42.02 32.97,42.41 arc-90 33.24,42.68 33.28,42.68 arc-90 33.55,42.41 33.55,42.02 arc90 33.82,41.76 33.87,41.76 arc90 34.13,42.02 34.13,42.41 arc-90 34.4,42.68 34.45,42.68 arc-90 34.72,42.41 34.72,42.02 arc90 34.98,41.76 35.03,41.76 arc90 35.3,42.02 35.3,42.41 arc-90 35.56,42.68 35.61,42.68 arc-90 35.88,42.41 35.88,42.02 arc90 36.15,41.76 36.19,41.76 arc90 36.46,42.02 36.46,42.41 arc-90 36.73,42.68 36.77,42.68 arc-90 37.04,42.41 37.04,42.02 arc90 37.31,41.76 37.36,41.76 arc90 37.62,42.02 37.62,42.41 arc-90 37.89,42.68 37.94,42.68 arc-90 38.21,42.41 38.21,42.02 arc90 38.47,41.76 38.52,41.76 arc90 38.79,42.02 38.79,42.41 arc-90 39.05,42.68 39.1,42.68 arc-90 39.37,42.41 39.37,42.02 arc90 39.64,41.76 39.68,41.76 arc90 39.95,42.02 39.95,42.41 arc-90 40.22,42.68 40.27,42.68 arc-90 40.53,42.41 40.53,42.02 arc90 40.8,41.76 40.85,41.76 arc90 41.12,42.02 41.12,42.41 arc-90 41.38,42.68 41.43,42.68 arc-90 41.7,42.41 41.7,42.02 arc90 41.96,41.76 42.01,41.76 arc90 42.28,42.02 42.28,42.41 arc-90 42.55,42.68 42.93,42.68 43.18,42.93 v43.18,43.28 | U16.86 43.36,44.81 v43.32,44.85 | U7.15 29.31,30.84 v29.34,30.86
  Bottom 0.152: v43.18,43.28 43.18,44.72 v43.32,44.85 | v29.34,30.86 29.34,41.69 v30.06,42.41
AGND  (via drill 0.3, 0.35, 0.45, 0.55)  (1 unrouted)
  Top 0.152: JP6.2 TP2.TP | C36.2 41.02,81.54 v41.02,83.19
  Top 0.254: 26.67,43.18 U6.25 26.67,42.68 U6.15 | U6.11 26.15,42.18 v26.16,42.16 | U6.8 24.47,43.68 23.95,44.2 v23.95,44.83 | R22.1 17.69,42.42 C15.2
  Top 0.305: U1.5 5.79,21.26 v5.71,21.34 | U1.2 5.87,23.22 v5.84,23.24
  Top 0.33: U9.5 U9.7
  Top 0.406: 25.27,28.32 25.27,29.59 | U7.3 23.92,30.18 v24.13,29.97 | U7.5 23.57,28.89 v24.13,28.32 | U7.8 24.01,26.93 v24.13,27.05 | U7.1 24.01,31.48 v24.13,31.37
  Top 0.61: U3.2 v5.33,36.7 | U2.2 v6.99,28.45 | C12.2 19.37,48.83 v19.3,48.77 | U5.2 v13.46,47.24 | TP3.TP 3.81,48.26 JP4.1 | U4.4 v13.08,50.93
  Top 1.016: v26.04,85.47 25.99,85.43 Q3.1 | R19.1 v2.03,80.14 | C11.2 v14.22,36.2 | C5.2 12.61,31.37 v14.22,31.37 | R5.1 v14.22,33.15 | C10.2 12.18,39.59 v12.22,39.55 | C15.2 v17.65,41.15 | C21.2 v23.5,37.47 | C20.2 v21.46,36.7 | C17.2 v25.78,36.83 | R8.2 v10.67,44.07 | C28.2 v30.35,39.37 29.78,38.8 C18.2 | v31.75,32.38 C27.2 | C24.2 33.91,33.34 v33.91,32 | C1.2 15.28,23.37 v16.51,23.37 | C34.2 v16.51,29.97 | C13.2 29.59,47.92 v29.59,48.9 | C29.2 30.33,32.75 v30.33,31.83 | C30.2 24.58,34.71 v24.54,34.75 | C26.2 17.68,32 v17.63,32.05 | C23.2 v17.07,34.04 | C32.2 17.14,27.94 v16.76,28.32 | C33.2 17.25,25.91 v16.38,26.77 | C3.2 19.54,23.28 v19.53,23.27 | C2.2 24.63,23.43 v24.64,23.42 | C16.2 13.88,38.47 v13.87,38.46 | C14.2 12.36,40.96 v12.22,40.82 | C7.2 7.17,51.5 v7.11,51.56 | C8.2 v12.83,49.02
  Top 1.27: C6.2 14.88,27.59 v14.88,26.47 | C58.2 19.62,64.64 v18.29,64.64
  Bottom 0.61: D11.C 31.24,2.54 34.8,6.1 JP2.1
  other vias: 37.59,9.91 41.4,9.91 39.4,11.43 30.86,9.91 37.29,13.26 33.78,14.99 33.78,12.45 42.29,8.26 44.45,6.35 36.2,3.81 36.2,7.11 29.97,12.45 29.97,14.99 33.78,9.91 26.16,27.05 26.16,28.45 26.16,29.97 26.16,31.37 26.67,97.16 33.66,97.16 12.7,96.52 10.16,88.27 5.08,74.93 1.91,72.39 26.67,94.61 33.66,94.61 39.37,94.61 39.37,97.16 2.54,88.27 26.04,92.08 26.04,87 26.04,89.53 31.75,92.08 28.57,92.08 36.83,97.16 36.83,94.61 34.92,92.08 34.8,68.83 35.94,68.83 37.21,68.83 26.16,43.69 27.69,42.16 27.69,43.69 26.16,50.55 44.45,3.81 37.21,67.56 41.27,65.41 41.27,68.58 39.88,74.93 41.15,76.2 38.1,76.2 40.01,64.14 38.86,66.04 40.01,67.31 22.73,16 25.4,16 15.37,69.47 17.65,69.47 17.65,71.37 17.65,73.41 15.37,73.41 15.37,71.37 1.91,69.22 5.08,64.26 2.54,60.96 5.08,60.96 6.99,76.83 3.05,76.83 2.54,64.26 39.37,69.22 41.27,71.12 39.88,72.39 37.97,8.26 37.97,3.94 42.29,3.94
  pour Top (no thermals): 36.45,17.02 20.19,17.02 20.19,14.86 26.29,14.86 26.67,14.48 26.67,11.43 27.81,10.29 29.08,10.29 32,7.37 32,3.56 33.27,2.29 46.48,2.29 46.48,6.99
  pour Top (rank 3, no thermals): 24,84.58 28.32,84.58 28.32,91.06 40.64,91.06 40.64,105.92 -0.13,105.92 -3.81,102.23 -3.81,88.14 -1.14,85.47 11.43,85.47 17.27,91.31 17.27,93.6 24,93.6
  pour Top (no thermals): 23.37,31.88 23.37,26.54 26.92,26.54 26.92,31.88
  pour Top (no thermals): 26.54,44.45 26.8,44.45 26.8,51.05 25.27,51.05 24.13,49.91 24.13,48.13 24.38,47.88 26.16,47.88 26.54,47.5
  pour Top (no thermals): 34.42,69.22 34.42,68.45 35.94,68.45 35.94,65.66 36.32,65.28 37.59,65.28 39.62,63.25 40.01,63.25 42.04,65.28 42.04,77.34 37.59,77.34 37.08,76.83 37.08,69.98 36.32,69.22
  pour Top (rank 3, no thermals): -2.92,81.92 14.35,81.92 16.51,79.76 16.51,77.47 11.43,77.47 6.35,72.39 6.35,71.12 8.51,68.96 8.51,64.26 6.86,62.61 6.86,59.94 -2.92,59.94
  pour Route2 (rank 2): 40.64,105.41 40.64,84.84 42.04,83.44 42.04,65.28 39.5,62.74 39.5,61.72 32.13,54.36 32.13,39.62 36.2,35.56 36.2,32 34.42,30.23 34.42,19.18 39.75,13.84 40.51,13.84 46.74,7.62 46.74,-2.79 -6.22,-2.79 -6.22,99.57 0.13,105.92 40.13,105.92
  pour Top (rank 3, no thermals): 14.99,74.42 20.32,74.42 21.21,73.53 21.21,68.33 21.08,68.2 19.3,68.2 17.14,66.04 17.14,65.79 14.99,63.63 13.97,63.63 13.46,64.14 13.46,69.22 13.84,69.6 13.84,73.28
ASW-1  (via drill 0.3)
  Top 0.152: U1.1 v8.76,23.88 | U16.1 46.13,35.18 v46.1,35.18
  Bottom 0.152: v8.76,23.88 11.05,23.88 12.95,25.78 33.4,25.78 41.4,33.78 44.7,33.78 v46.1,35.18
ASW-2  (via drill 0.3)
  Top 0.152: U1.16 13.72,24.38 v13.72,24.51 | v46.99,34.29 47.37,34.29 48.09,35.01 U16.3
  Bottom 0.152: v13.72,24.51 14.22,25.02 33.66,25.02 41.66,33.02 45.72,33.02 v46.99,34.29
ASW-3  (via drill 0.3)
  Top 0.152: U1.9 13.59,18.92 v14.48,18.92 | v48.01,34.16 48.59,34.74 U16.4
  Bottom 0.152: v14.48,18.92 14.48,23.24 15.88,24.64 33.78,24.64 41.78,32.64 46.48,32.64 v48.01,34.16
ASW-4  (via drill 0.3)
  Top 0.152: U1.8 v8.76,19.3 | v46.1,34.29 46.74,34.92 47.37,34.92 47.59,35.14 U16.2
  Bottom 0.152: v8.76,19.3 11.05,21.59 11.05,23.37 13.08,25.4 33.53,25.4 41.53,33.4 45.21,33.4 v46.1,34.29
BUTTON_DOWN
  Top 0.152: U16.53 58.09,52.87 58.63,53.42 65.79,53.42 67.31,51.89 67.31,49.53 JP24.1
BUTTON_ENTER
  Top 0.152: U16.58 55.59,52.52 58,54.94 70.28,54.94 73.66,51.56 JP24.6
BUTTON_ESC
  Top 0.152: U16.57 56.09,52.59 58.13,54.63 69.19,54.63 72.39,51.44 72.39,49.53 JP24.5
BUTTON_MEASURING  (via drill 0.3)
  Top 0.152: U16.35 62.07,42.31 v62.1,42.35 63.52,42.35 68.04,46.86 74.3,46.86 74.93,47.5 74.93,49.53 JP24.8
  Bottom 0.152: JP17.3 67.82,70.48 67.82,55.63 61.09,48.9 61.09,43.36 v62.1,42.35
BUTTON_NEXT
  Top 0.152: U16.55 57.09,52.73 58.38,54.03 67.18,54.03 69.85,51.36 69.85,49.53 JP24.3
BUTTON_PREV
  Top 0.152: U16.54 57.59,52.8 58.51,53.72 66.29,53.72 68.58,51.44 JP24.2
BUTTON_UP
  Top 0.152: U16.56 56.59,52.66 58.26,54.33 68.22,54.33 71.12,51.44 JP24.4
BUZZER  (via drill 0.3)
  Top 0.152: U16.40 65.14,44.81 v65.53,45.21
  Bottom 0.152: v65.53,45.21 65.66,45.34 83.44,45.34 JP24.15
CTS  (via drill 0.3)
  Top 0.152: U21.4 v89.17,84.8 v89.18,84.78 | v86.74,78.89 87.31,78.32 87.31,77.81 U18.6
  Bottom 0.152: v89.18,84.78 86.74,82.35 v86.74,78.89
CURR_CONT  (via drill 0.3)
  Top 0.254: R26.2 60.15,27.56 v60.88,26.82 | VR2.5 82.53,17.91 v81.79,17.91 | VR1.5 74.91,17.91 v74.17,17.91
  Bottom 0.254: v60.88,26.82 60.88,21.34 64.31,17.91 v74.17,17.91 v81.79,17.91
CURR_CONT_LOW
  Top 0.305: U11.1 55.74,25.64 56.86,26.76 R24.2
CURR_MEAS_POS  (via drill 0.3, 0.35)
  Top 0.152: U1.7 7.34,19.94 | 7.34,19.94 TP4.TP | 7.34,19.94 9.78,19.94 12.06,17.65 19.05,17.65 19.43,17.27 19.43,16.57 R1.1
  Bottom 0.61: JP1.1 18.92,6.1 22.61,2.41 25.76,2.41 D11.A
  other vias: 11.3,3.05 18.16,3.05 17.78,9.4 19.18,13.21 14.73,11.68 11.3,9.27 16.79,15.49 12.6,8.23 16.89,8.26 16.89,3.94 12.57,3.94
  pour Top (no thermals): 19.43,17.02 19.43,14.86 20.19,14.1 21.46,14.1 22.1,13.46 22.1,3.56 20.83,2.29 10.29,2.29 10.29,11.56 15.75,17.02
CURR_POT_HIGH
  Top 0.305: U11.10 58.94,25.64 58.17,26.42 58.17,27.52 R26.1
CURR_SRC_OUT  (via drill 0.3)  (6 unrouted)
  Top 0.152: VR2.9 84.07,12.84 C47.1 | VR1.10 76.95,12.56 C48.1
  Top 0.254: VR2.9 84.07,14.74 | 82.8,3.56 v82.55,3.81 | v82.55,3.81 JP5.1 v82.55,3.81 | 76.07,11.68 76.07,5.21 77.85,3.43 78.49,3.43 | C47.1 85.22,11.69 85.22,5.08 83.57,3.43 82.93,3.43 v82.55,3.81
  Top 0.305: VR2.10 84.57,12.34 C47.1 85.22,11.68 | VR1.9 76.45,12.58 C48.1 76.07,11.68
  Bottom 1.016: D9.2 80.39,5.46 JP5.1
  other vias: 78.74,3.81 82.55,7.62 78.74,7.62
  pour Top (no thermals): 76.33,15.49 77.47,15.49 78.11,14.86 78.11,11.94 77.6,11.43 75.95,11.43 75.56,11.81 75.56,13.34 76.33,14.1
  pour Top (no thermals): 83.95,15.49 85.09,15.49 86.11,14.48 86.11,12.06 85.47,11.43 83.82,11.43 83.19,12.06 83.19,13.59 83.95,14.35
EXTRA_GPIO  (via drill 0.3)
  Top 0.305: U16.36 59.93,42.81 58.8,43.94 v58.8,45.47
  Bottom 0.305: JP17.2 67.36,72.57 67.36,55.75 58.8,47.19 v58.8,45.47
GND  (via drill 0.3, 0.45)
  Top 0.152: Q9.2 46.59,72.41 45.36,71.18 Q9.4 45.34,71.03 | C90.2 45.34,71.03 | C89.2 45.12,70.82 45.34,71.03 | SJ27.1 v36.2,37.21 | R53.1 v37.72,34.16
  Top 0.254: U16.19 56.09,35.1 v56.52,34.67 | U16.10 51.59,34.65 v51.94,34.29
  Top 0.305: v60.86,36.96 60.77,37.05 U16.26 | U16.49 62.6,49.31 v62.84,49.55 | U16.74 47.59,52.72 v47.3,53.01 | U16.99 44.26,38.31 v43.81,37.87 | VR1.8 VR1.11 | VR2.8 VR2.11 | U13.5 U13.7 | U11.7 58.31,24.14 v58.22,24.23 | U12.3 U12.2 54.24,17.26 v53.85,17.65 | U12.7 58.18,16.26 v58.17,16.28 | LED7.C 97.55,63.11 v97.41,63.25 | LED6.C 97.93,59.04 v97.54,59.44 | LED8.C 97.17,68.19 v97.16,68.2 | U13.3 77.45,22.97 v77.6,23.11
  Top 0.406: v86.23,70.99 86.17,71.06 U18.9 | U18.15 89.98,71.31 v90.17,71.12
  Top 0.813: U17.7 49.66,21.08 v49.53,21.21
  Top 1.016: C106.2 45.76,78.78 v45.85,78.87 46.14,79.16 R78.1 | v66.55,83.82 C107.2 | v66.55,81.79 R79.1 | v63.75,33.43 62.45,33.43 C78.2 C80.2 | R24.1 v53.98,27.56 | C88.2 v94.74,72.14 | C98.2 50.29,74.08 v50.29,75.18 | Q10.2 92.68,47.82 R66.2 92.71,47.79 v92.71,46.74 | C43.2 41.91,28.23 JP11.2 | C84.2 63.14,36.13 63.55,35.73 64.77,35.73 C87.2 | v43.2,34.95 43.22,34.96 C81.2 | C62.2 78.82,65.13 v78.74,65.05 | R68.1 48.97,76.45 v48.49,76.94 | C77.2 66.26,51.29 v66.27,51.28 | R77.1 v66.55,79.76 | C104.2 60.39,79.82 v60.45,79.88 | C101.2 61.09,75.27 v61.09,75.18 | C95.2 v50.42,68.45 | C94.2 v50.42,70.48 | C96.2 v56.13,63.25 | C97.2 v58.17,62.74 | R56.2 v60.2,63.25 | C82.2 62.98,52.56 v62.99,52.58 | C83.2 45.64,54.94 v44.96,55.63 45.31,55.27 C75.2 | C85.2 45.12,21.17 v45.09,21.21 | U17.1 v48.39,12.45 | U17.2 v49.66,12.45 | U17.3 v50.93,12.45 | U17.4 v52.2,12.45 | R25.1 55.46,21.04 v55.5,21.08 | C55.2 56.81,20.92 v56.77,20.95 | v65.02,12.83 65.02,13.74 C52.- 63.75,13.74 v63.75,12.83 | C50.2 62.23,15.15 v62.23,14.1 | v65.15,20.45 65.15,21.36 C51.- 63.88,21.36 v63.88,20.45 | C54.2 61.81,21.08 62.48,21.08 v62.61,20.95 | C49.2 62.48,22.9 v62.48,22.23 | C56.2 73.21,21.91 v73.15,21.97 | v78.99,14.86 78.99,15.74 C41.2 80.64,15.62 v80.64,14.86 | C48.2 v79.5,10.8 v79.5,10.79 | C47.2 v81.78,10.8 v81.79,10.79 | S1.2 68.87,28.61 v68.83,28.57 | S1.2 67.33,30.34 v67.31,30.35 | S1.2 70.72,30.34 v70.74,30.35 | S1.2 68.87,31.97 v68.83,32 | v76.83,32.13 76.82,32.12 S1.4 76.84,30.35 v78.23,30.35 | R59.2 78.53,33.57 v78.49,33.53 | C93.2 78.55,31.81 v78.49,31.75 | C91.2 v84.84,29.84 | C53.2 60.96,13.8 v60.96,12.57 | C72.2 v65.66,31.08 v65.66,31.07
  Top 1.27: C57.2 v83.31,25.65 | C87.2 66.39,35.55 v66.4,35.56
  Bottom 0.508: D7.2 v51.05,93.98
  Bottom 0.61: D6.2 v97.66,34.8 | C108.2 v51.56,97.03
  Bottom 1.016: C86.2 v52.07,41.66 | J3.3 79.51,65.82 v78.74,65.05 78.61,65.18 C63.2 | R21.1 v73.53,9.53
  Bottom 1.27: J3.GND4 97.07,79.55 97.03,79.5 v97.09,79.44 | J3.GND3 94.68,54.04 v94.61,54.1 | J3.GND2 82.57,54.63 v82.55,54.61
  other vias: 83.19,33.4 83.19,31.75 56.77,72.64 87,14.61 92.71,15.88 82.42,16.51 84.71,16.51 87,6.99 77.09,16.51 74.8,16.51 87,12.06 91.44,17.78 89.53,12.06 89.53,9.53 87,9.53 95.76,14.61 91.44,21.59 95.25,17.14 93.34,12.06 97.79,17.14 97.16,12.06 73.03,14.61 70.48,14.61 70.48,12.06 67.94,14.61 67.94,12.06 73.03,17.14 70.48,17.14 70.48,19.68 73.03,19.68 67.94,19.68 67.94,17.14 90.17,14.61 87,4.45 80.64,9.27 83.19,9.27 77.85,9.27 70.48,9.53 70.48,6.86 43.43,69.47 55.8,5.77 94.36,21.59 97.79,21.59 92.71,19.56 77.6,24.26 63.55,5.77 63.55,3.1 55.8,3.23 53.26,5.77 53.26,3.23 53.26,8.31 55.8,8.31 54.64,9.65 58.34,9.58 60.88,9.58 64.72,9.6 63.42,8.31 65.96,8.31 65.96,5.77 65.96,3.23 70.48,4.32 70.48,1.78 75.56,1.78 89.53,1.78 85.72,1.78 81.92,1.78 73.03,12.06 70.74,21.84 87,16.38 89.53,16.38 75.95,16.51 83.57,16.51 97.16,24.77 94.61,24.77 92.08,24.77 89.53,26.04 87,28.57 97.16,27.3 97.16,29.84 97.16,32.38 87,40.01 88.27,43.81 89.53,41.27 93.34,37.47 97.79,44.7 98.3,40.39 98.3,37.85 86.74,34.54 42.67,84.33 42.67,88.14 42.67,91.95 42.67,97.03 47.75,91.95 46.48,88.14 46.48,84.33 49.02,84.33 54.61,84.84 63.25,97.16 60.71,85.22 63.5,91.06 62.1,88.01 58.93,87.88 60.45,90.81 58.55,92.96 54.86,98.17 51.94,98.3 63.5,94.87 42.55,94.61 44.96,90.3 63.75,86.11 80.52,56.52 80.64,53.98 84.45,53.98 87,53.98 87,56.52 87,59.05 87,61.59 84.45,61.59 97.16,56.52 94.61,56.52 92.2,56.52 92.2,53.98 97.79,49.66 82.55,52.2 81.28,62.1 98.42,84.2 92.58,81.03 95.5,78.87 91.95,84.45 97.16,75.31 97.16,71.12 94.61,75.31 93.47,70.1 93.34,66.67 90.68,68.71 89.03,66.67 87,64.26 86.36,68.07 78.23,54.1 89.66,74.93 86.49,74.93 84.84,76.96 80.14,72.26 85.6,80.52 57.53,7.87 61.85,7.87 61.85,3.56 57.53,3.56
  pour Top (no thermals): 50.04,35.05 50.04,30.86 48.64,29.46 48.64,25.15 49.15,24.64 52.58,24.64 52.96,25.02 52.96,28.96 52.45,29.46 52.45,34.54 51.94,35.05
  pour Top (no thermals): 51.94,35.05 54.99,35.05 55.88,34.16 58.93,34.16 58.93,31.11 56.9,29.08 53.34,29.08 52.83,29.59 52.83,33.02 51.56,34.29 51.56,34.67
  pour Top (no thermals): 53.85,72.64 55.63,72.64 55.75,72.52 55.75,71.88 55.12,71.25 48.77,71.25 48.01,70.48 48.01,67.94 47.24,67.18 44.2,67.18 42.55,68.83 42.55,75.31 43.18,75.95 48.01,75.95 48.77,75.18 48.77,73.66 49.28,73.15 53.34,73.15
  pour Route2 (rank 2): 40.89,86.11 40.89,84.96 42.42,83.44 42.42,65.15 40.01,62.74 40.01,61.59 32.51,54.1 32.51,39.75 36.58,35.69 36.58,31.88 34.8,30.1 34.8,19.3 39.88,14.22 40.77,14.22 47.12,7.87 47.12,-2.67 102.62,-2.67 102.62,105.16 35.05,105.16 33.91,104.01 33.91,88.01 35.81,86.11
  pour Top (no thermals): 51.94,9.02 53.72,10.79 65.15,10.79 66.8,9.14 66.8,-1.4 51.94,-1.4
  pour Top (rank 3, no thermals): 102.36,22.99 89.41,22.99 85.34,27.05 74.8,27.05 66.93,19.18 66.93,10.41 67.94,9.4 67.94,-1.91 102.36,-1.91
  pour Top (no thermals): 82.42,34.16 83.95,34.16 83.95,33.15 85.22,33.15 85.22,32.13 84.07,32.13 84.07,30.86 82.42,30.86 82.42,32 81.15,32 81.03,32.13 81.03,33.15 81.15,33.27 82.42,33.27
  pour Top (rank 2, no thermals): 107.06,23.24 90.04,23.24 86.23,27.05 86.23,43.69 88.01,45.47 107.06,45.47
  pour Top (no thermals): 41.4,102.23 41.4,83.95 43.56,81.79 62.87,81.79 64.52,83.44 64.52,102.23
  pour Bottom (no thermals): 105.92,86.11 81.15,86.11 76.45,81.41 76.45,54.86 82.42,48.9 102.49,48.9 105.92,52.32
GND_EXT  (via drill 0.3, 0.45)
  Top 0.305: U21.13 85.26,83.1 85.98,83.82 U21.EXP 86.56,84.14 U21.3
  Top 0.406: U18.2 89.98,78.44 v90.67,79.13 90.67,79.8 C99.2 | U18.8 86.17,78.42 v85.72,78.87
  Top 0.813: C103.2 90.26,87.54 v90.3,87.5
  Top 1.016: C109.2 73.66,88.99 v73.66,87.76 | C92.2 93.56,78.83 v93.6,78.87 | C105.2 81.75,87.54 v81.48,87.81 | C22.2 80.14,85.85 v79.96,86.03 | C100.2 81.31,81.88 C102.2 78.29,81.88 v78.28,81.89
  Bottom 0.508: D8.2 v72.64,92.2
  other vias: 86.23,83.82 71.63,97.79 71.63,95.89 74.17,94.36 76.33,95.38 83.69,97.79 80.01,97.16 83.82,95.38 83.82,92.08 88.27,97.79 86.49,94.23 88.27,92.71 76.45,97.79 71.75,93.98 88.39,95.38
  pour Route2: 69.6,101.09 69.6,89.66 82.8,76.45 102.23,76.45 102.23,101.35 69.85,101.35
  pour Top (no thermals): 69.98,104.14 69.98,92.71 71.88,90.81 88.39,90.81 89.41,91.82 89.41,104.14
I2C4_SCL  (via drill 0.3)
  Top 0.152: R81.1 46.95,17.65 50.16,17.65 50.93,18.41 U17.6 v50.93,21.08 52.96,23.11 54.93,23.11 U11.5 | U12.5 53.99,15.76 v53.85,15.62 | v53.11,48.23 53.24,48.23 55.09,50.08 U16.59 55.09,52.58 57.75,55.24 71.12,55.24 74.3,52.07 77.47,52.07 JP24.10
  Bottom 0.152: v53.85,15.62 50.93,18.54 v50.93,21.08 50.42,21.59 50.42,46.3 52.35,48.23 v53.11,48.23
I2C4_SDA  (via drill 0.3)
  Top 0.152: R80.1 46.86,15.75 48.39,17.27 50.29,17.27 52.2,19.18 U17.5 | U11.4 v54.23,24.13 | v52.2,21.08 U17.5 | U12.4 53.59,16.26 52.2,17.65 U17.5 | v52.58,47.62 52.58,48.64 54.59,50.65 U16.60 54.59,52.58 57.56,55.55 72.14,55.55 74.98,52.7 79.38,52.7 JP24.12
  Bottom 0.152: v54.23,24.13 52.2,22.1 v52.2,21.08 50.81,22.47 50.81,45.85 v52.58,47.62
LAN_LED1  (via drill 0.3)
  Top 0.254: U20.3 53.19,72.89 v53.16,72.92
  Bottom 0.254: v53.16,72.92 53.16,72.95 53.21,73 53.21,78.61 50.41,81.41 T1.10
LAN_LED2  (via drill 0.3)
  Top 0.254: U20.2 53.99,73.39 v53.85,73.53
  Top 0.305: R79.2 59.82,81.79 T1.12
  Bottom 0.254: v53.85,73.53 53.85,79.12 55.75,81.03 57.03,81.03 T1.12
LED_BLUE  (via drill 0.3)
  Top 0.305: JP24.13 85.22,46.86 86.87,46.86 87.76,47.75 87.76,62.61 89.53,64.39 R84.2 | U16.41 64.72,45.31 65.28,45.87 v66.29,45.87
  Bottom 0.305: JP24.13 81.41,45.85 66.32,45.85 v66.29,45.87
LED_GREEN  (via drill 0.3)
  Top 0.305: JP24.11 83.31,46.23 87.12,46.23 88.39,47.5 88.39,61.21 89.53,62.36 R83.2 | U16.45 66.22,47.31 v66.8,46.74
  Bottom 0.305: JP24.11 79.38,46.35 67.18,46.35 v66.8,46.74
LED_RED  (via drill 0.3)
  Top 0.305: JP24.9 81.41,45.59 87.38,45.59 89.03,47.24 89.03,59.56 89.79,60.33 R82.2 | U16.46 66.74,47.81 v66.8,47.75
  Bottom 0.305: JP24.9 77.34,46.86 67.69,46.86 v66.8,47.75
MA_RANGE_SENSE  (via drill 0.3, 0.35)
  Top 0.152: v28.98,4.77 27.94,4.77 R3.E2 | U1.15 11.96,23.22 v11.94,23.24 11.94,24.26 TP8.TP
  Bottom 0.152: v11.94,23.24 11.94,20.32 11.05,19.43 11.05,18.64 24.92,4.77 v28.98,4.77
MA_RANGE_SENSE_Q
  Top 0.152: Q11.3 26.31,7.62 R3.I2 | Q11.2 27.55,6.35 R3.I2 | Q11.1 26.27,5.08 R3.I2
  pour Top (no thermals): 23.11,8.26 28.45,8.26 29.08,7.62 29.08,5.71 28.7,5.33 26.67,5.33 26.16,4.83 26.16,4.06 25.78,3.68 23.62,3.68 22.73,4.57 22.73,7.87
N$1
  Top 0.152: U3.1 6.6,39.29 C9.2 6.52,40.97 R10.1 R12.1
N$2
  Top 0.152: R9.1 R10.2
N$3
  Top 0.152: U3.4 8.64,35.75 8,36.39 8,39.16 C9.1 8.22,40.64 R9.2 R8.1
N$4
  Top 0.152: R6.2 R7.1
N$5
  Top 0.152: C4.2 7.91,31.24 TP14.TP | U2.1 8.38,30.78 C4.2 | U3.3 6.6,33.83 R7.2 7.62,31.54 C4.2
N$6
  Top 0.152: U1.6 8.05,20.62 10.22,22.8 10.22,22.92 | U1.11 12.52,20.62 10.22,22.92 | U1.14 11.43,22.55 10.22,23.76 | 10.22,22.92 10.22,23.76 | U1.3 9.02,22.55 10.22,23.76 | 10.22,23.76 10.22,25.55 R4.1 11.68,25.65 TP13.TP
N$7
  Top 0.152: U2.4 10.35,27.5 9.74,28.11 C4.1 9.74,32.72 R6.1 9.99,33.15 R5.2
N$8
  Top 0.406: U1.13 14.95,21.92 15.28,21.59
  Top 1.016: L1.1 15.28,21.59 C1.1
N$13
  Top 0.152: U16.13 53.09,34.8 53.85,34.04 55.08,34.04 55.87,33.25 Q8.1 55.93,33.36 C76.1
N$14
  Top 0.254: R23.1 19.05,44.16 17.78,44.16 | 17.78,44.16 C15.1 | R40.2 17.78,45.81 17.78,44.16
N$15
  Top 0.152: U2.3 8.42,27.45 R4.2
N$16
  Bottom 1.016: D9.1 73.46,7.33 R21.2
N$17
  Top 0.254: U6.10 24.13,42.68 23.5,42.04 22.77,42.04 C19.2 21.39,42.08 R22.2
N$18
  Top 0.152: U16.12 52.59,34.72 53.34,33.96 53.34,32.64 53.95,32.03 Q8.3 54.17,30.25 C79.1
N$20
  Top 0.152: C59.1 4.48,66.84 5.33,67.69 6.27,67.69 U8.3
N$23
  Top 0.152: Q4.4 39.06,78.2 R20.2 40.68,78.14 C36.1
N$24
  Top 0.61: C8.1 16.31,49.16 U4.5
N$39
  pour Top (rank 2, no thermals): 21.21,83.06 21.21,79.38 28.32,79.38 28.32,84.07 22.23,84.07
N$40
  Top 0.406: U7.6 19.94,28.23 C32.1
  Top 1.016: C32.1 19.65,25.93 C33.1
N$41
  Top 0.406: C34.1 20.31,29.54 U7.4
N$42
  pour Top (no thermals): 23.5,86.23 23.5,84.58 21.97,84.58 20.57,83.19 20.57,79.38 16.26,79.38 14.48,81.15 14.48,83.44 15.11,84.07 17.91,84.07 20.07,86.23
N$44
  Top 0.152: R19.2 LED1.C
N$47
  Top 0.152: U4.3 12.19,52.2 13.72,53.72 13.72,54.74 14.48,55.5 18.03,55.5 18.8,54.74 TP9.TP
N$48
  pour Top (no thermals): 26.16,44.45 26.04,44.45 26.04,45.47 25.27,45.47 25.27,44.07 24.77,44.07 24.51,44.32 24.51,46.1 24.77,46.35 24.77,47.5 25.91,47.5 26.16,47.24
N$49
  Top 1.016: C25.1 23.05,47.6 R16.1
N$50
  Top 0.152: U6.14 U6.13
  pour Top (no thermals): 26.29,41.27 26.29,38.99 25.15,38.99 25.15,40.89 25.53,41.27
N$51
  Top 0.152: U5.4 12.64,43.94 12.64,44.52 13.08,44.96 13.72,44.96 14.29,45.53 14.29,45.98 U5.1
  Top 0.254: U5.1 15.78,46.11 R40.1
N$56
  Top 0.152: U16.9 51.09,29.75 51.5,29.33 Q7.2 51.37,28.96 51.37,27.84 C74.1
N$57
  Top 0.152: U16.8 50.59,29.57 50.58,29.57 Q7.1 50.1,27.71 C73.1
N$58
  Top 0.203: R70.1 97.36,80.66 LED4.A
N$59
  Top 0.61: R11.2 20.68,50.46 C12.1
N$60
  Top 0.203: LED5.A 97.64,85.74 R73.1
N$61
  Top 0.254: C75.1 48.09,55.24 U16.73
N$62
  Top 0.254: U6.9 24.13,43.18 23.53,43.78 C19.1 22.35,44.16 21.34,44.16 R23.2
N$63
  pour Top (rank 2, no thermals): 17.65,93.22 23.62,93.22 23.62,86.61 19.68,86.61 17.53,84.45 14.86,84.45 13.97,83.57 13.97,82.3 -1.4,82.3 -1.4,85.09 11.68,85.09 17.65,91.06
  pour Route15 (rank 4): -2.16,81.03 19.35,81.03 24.51,86.18 24.51,102.11 -2.16,102.11
N$64
  Top 0.254: U16.48 63.47,48.81 64.05,49.39 C77.1
N$66
  Top 0.152: 37.72,38.23 38.43,37.51 40.71,37.51 44.01,40.81 U16.94 | SJ27.2 37.72,38.23 | R53.2 37.72,38.23
N$67
  Top 0.254: U16.20 U16.21 57.09,35.24 57.53,34.8 60.36,34.8 C78.1 C80.1
  Top 1.016: C80.1 60.74,30.46 L4.2
N$68
  Top 0.305: LED8.A 96.25,64.39 R84.1
N$70
  Top 0.406: R67.2 97.89,47.13 LED3.A
N$72
  Top 0.305: R83.1 94.82,61.61 LED7.A
N$73
  Top 0.406: LED3.C 96.74,48.63 Q10.3
N$74
  Top 0.305: R82.1 96.85,57.54 LED6.A
N$75
  Top 0.305: R78.2 47.88,80.17 T1.9
N$76
  Top 0.152: R65.1 47.48,74.15 47.48,74.06 49.15,72.39 U20.4
N$77
  Top 0.305: U20.24 53.63,76.45 R68.2
N$78
  Top 0.406: LED2.C 97.23,50.69 96.48,51.44 R62.1
N$79  (via drill 0.3, 0.45)
  Top 0.152: R71.2 49.28,80.73 v49.28,81.53 | R74.2 53.59,81.41 v53.72,81.53 | R72.2 56.48,80.48 v56.77,80.19 | R69.2 51.56,81.28 v51.82,81.54
  Top 0.254: U20.1 54.31,73.89 54.09,74.11 52.1,74.11 C98.1
  Top 0.305: v56.07,94.04 54.04,94.04 T1.2 46.61,90.17 44.45,88.01 C106.1 | C107.1 63.28,84.2 57.4,84.2 T1.5 | U20.19 58.02,76.01 C101.1
  Top 1.016: C98.1 52.03,75.01 v52.38,75.36 | C101.1 58.33,78.2 C104.1 58.42,78.42 v58.42,79.88 | L5.2 v61.85,76.45 | L5.2 63.14,77.95 v63.12,77.98 | L5.2 63.14,75.08 v63.12,75.06
  Bottom 0.305: T1.5 55.12,88.77 55.75,88.77 56.52,89.53 56.52,93.6 v56.07,94.04 | v56.07,94.04 56.01,93.98 D7.5 | C108.1 54.74,97.03 56.07,95.69 v56.07,94.04
  pour Route15: 46.48,87.5 46.48,76.83 48.9,74.42 63.25,74.42 63.75,74.93 63.75,85.09 57.91,90.93 49.91,90.93
N$80
  Top 0.254: U20.9 56.52,69.47
  Top 0.61: 56.52,69.47 56.52,69.09
  Top 1.016: C97.1 56.52,67.75 | 56.52,67.75 56.52,69.09 | C96.1 56.52,66.51 56.52,67.75
N$81
  Top 0.254: U20.6 54.85,70.85 54.61,70.61
  Top 0.61: C94.1 53.55,70.61 54.61,70.61
  Top 1.016: C95.1 C94.1
N$82
  Top 0.406: R67.1 95.03,45.68 97.16,43.56 97.16,35.81 91.31,29.97 87,29.97 85.72,28.7 82.17,28.7 81.89,28.99 81.89,30.03
  Top 0.61: U19.5 81.89,30.03 C91.1
  Top 1.016: C91.1 80.08,29.84 | 80.08,29.84 C93.1 | L7.2 74.47,28.35 78.08,28.35 79.58,29.84 80.08,29.84
N$83
  Top 0.152: R65.2 45.38,72.72 Q9.3 43.59,72.71 C90.1
N$84
  Top 0.152: U20.5 47.3,71.89 46.59,71.18 Q9.1 46.82,70.82 C89.1
N$85
  Top 0.61: LED12.C R87.1
N$86
  Top 0.61: LED9.C R86.1
N$87
  Top 0.61: LED10.C R85.1
N$96
  Top 0.305: R77.2 62.52,80.9 58.8,80.9 56.9,82.8 T1.11
NRST  (via drill 0.3)
  Top 0.152: U16.14 53.59,37.46 v53.59,37.47 52.32,38.73 49.78,38.73 49.15,39.37 v49.15,40.89 | JP24.7 76.2,47.37 74.93,46.1 74.93,40.13 73.53,38.73 v72.01,38.73 | R52.1 44.63,60.2 JP25.5
  Top 0.254: S1.3 S1.1 67.85,33.82 C72.1 64.56,31.67 v64.21,31.67
  Bottom 0.152: v64.21,31.67 66.75,31.67 72.01,36.93 v72.01,38.73 | v49.15,40.89 49.98,41.73 49.98,54.84 JP25.5
  Bottom 0.254: v53.59,37.47 53.59,34.52 56.44,31.67 v64.21,31.67
PA0  (via drill 0.3)
  Top 0.152: U16.22 57.59,37.41 v57.53,37.47 | v69.34,37.59 69.85,37.08 75.44,37.08 77.6,39.24 78.87,39.24 80.01,40.39 80.01,42.29 JP12.10
  Bottom 0.152: v57.53,37.47 58.67,36.32 68.07,36.32 v69.34,37.59
PA3  (via drill 0.3)
  Top 0.152: U16.25 59.09,36.73 v59.56,37.21 | v68.71,38.61 69.09,38.61 70.28,37.41 75.26,37.41 78.74,40.89 JP12.9
  Bottom 0.152: v59.56,37.21 60.96,38.61 v68.71,38.61
PA10  (via drill 0.3)
  Top 0.152: U16.69 50.09,52.4 v49.4,53.09 | v48.13,49.66 46.86,48.39 v46.64,48.39